# EAGLE schematic swift-nav (EAGLE 6.2)

## Sheet 1 of 7
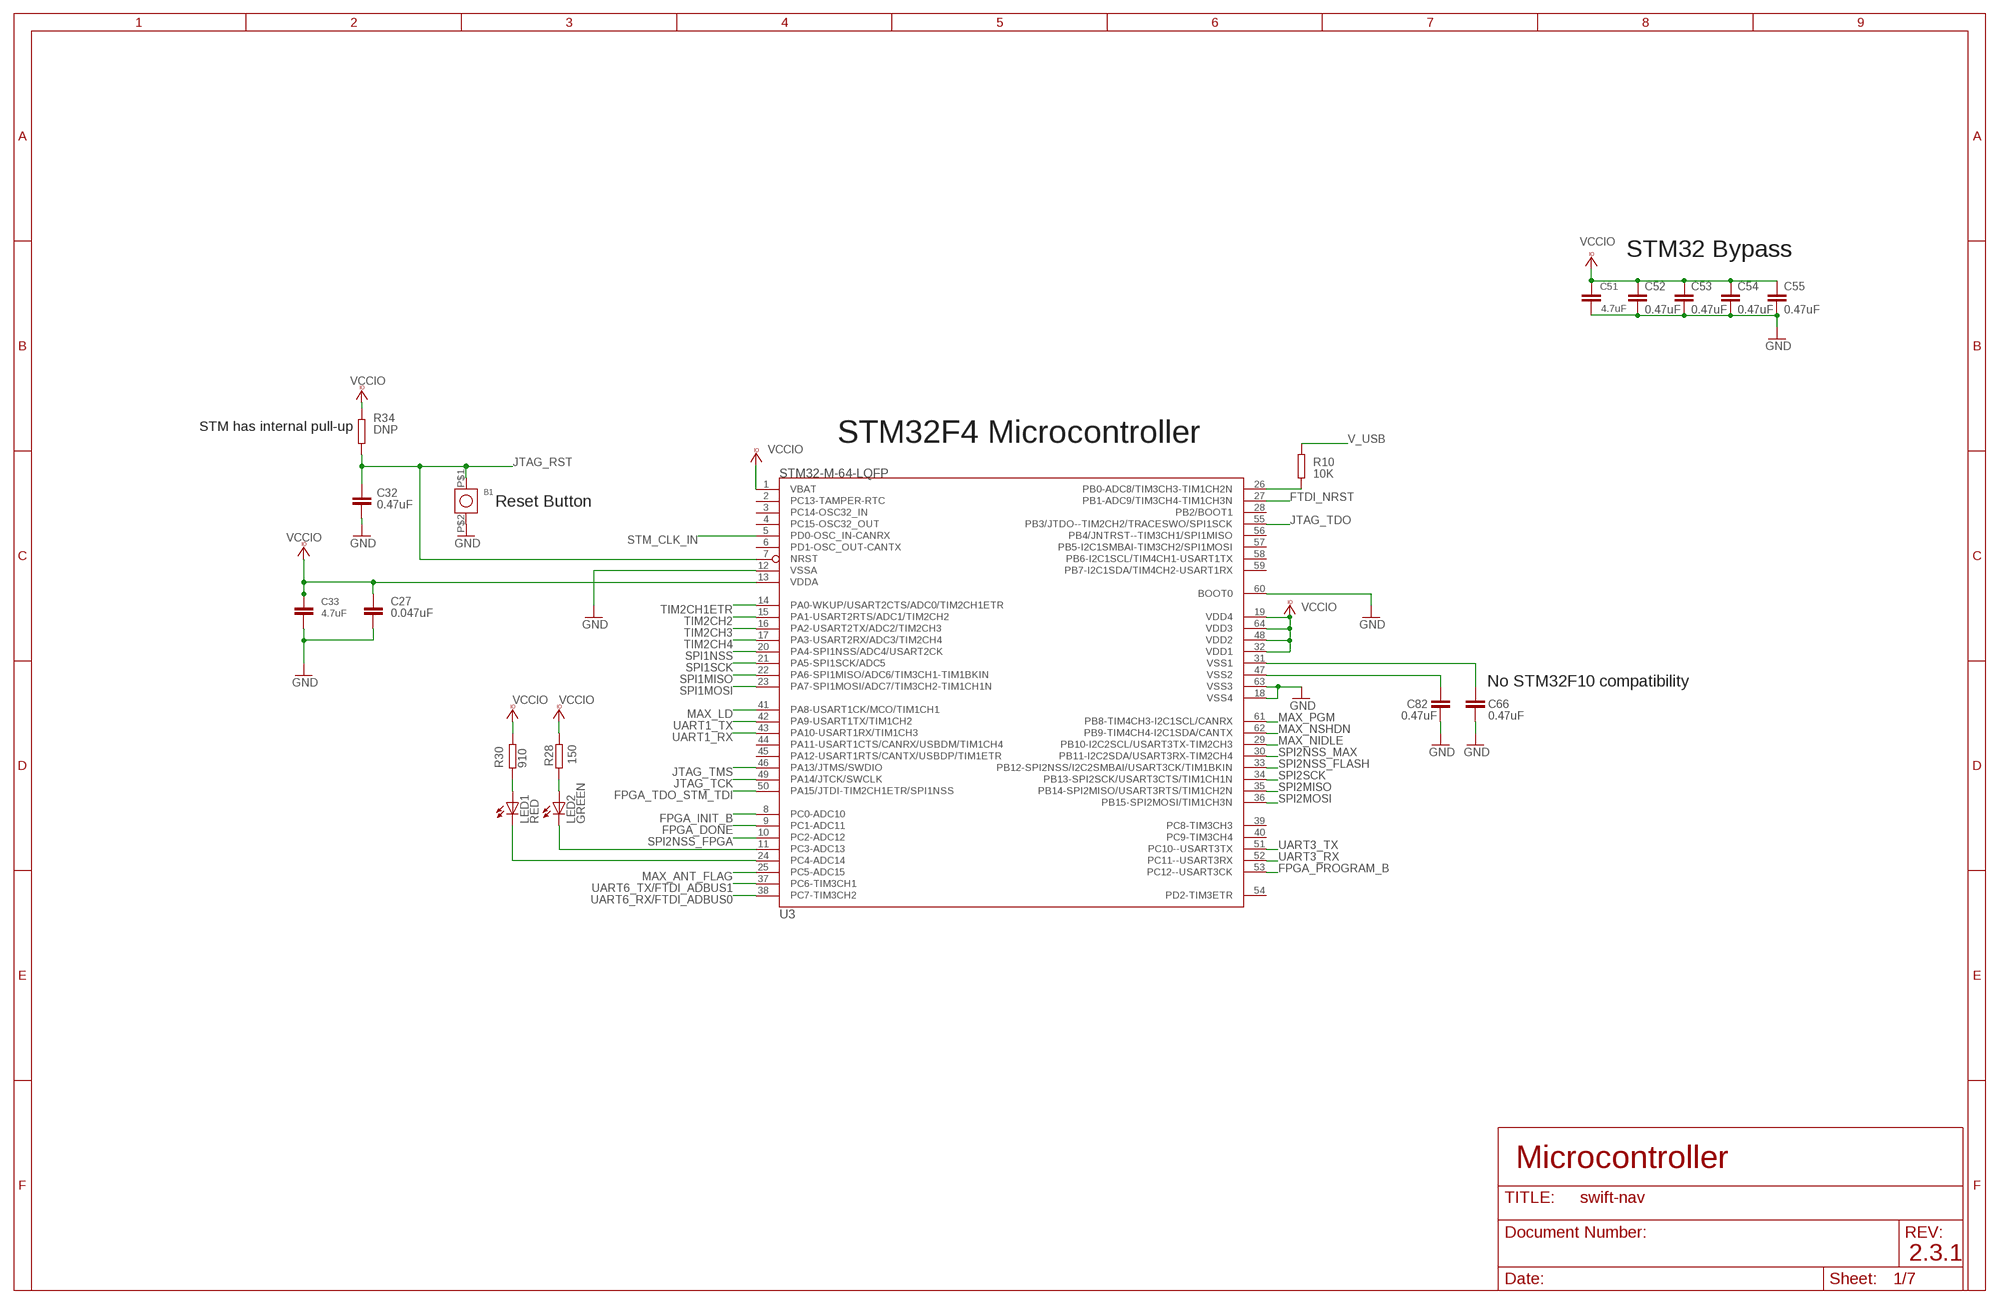
[diagram p0: schematic, sheet 1]

### Parts
B1  B3U-1000P  [B3U-1000P]
C27  0.047uF  CAPACITOR-0402  [0402-CAP]
C32  0.47uF  CAPACITOR-0402  [0402-CAP]
C33  4.7uF  CAPACITOR-0603  [0603-CAP]
C51  4.7uF  CAPACITOR-0603  [0603-CAP]
C52  0.47uF  CAPACITOR-0402  [0402-CAP]
C53  0.47uF  CAPACITOR-0402  [0402-CAP]
C54  0.47uF  CAPACITOR-0402  [0402-CAP]
C55  0.47uF  CAPACITOR-0402  [0402-CAP]
C66  0.47uF  CAPACITOR-0402  [0402-CAP]
C82  0.47uF  CAPACITOR-0402  [0402-CAP]
LED1  RED  LED-0603  [0603-LED]
LED2  GREEN  LED-0603  [0603-LED]
R10  10K  RESISTOR-0402  [0402-RES]
R28  150  RESISTOR-0402  [0402-RES]
R30  910  RESISTOR-0402  [0402-RES]
R34  DNP  RESISTOR-0402  [0402-RES]
U3  STM32-M-64-LQFP  [LQFP64]

### Nets
FPGA_DONE: U3.9(PC1-ADC11) ; also sheet 2
FPGA_INIT_B: U3.8(PC0-ADC10) ; also sheet 2
FPGA_PROGRAM_B: U3.53(PC12--USART3CK) ; also sheet 2
FPGA_TDO_STM_TDI: U3.50(PA15/JTDI-TIM2CH1ETR/SPI1NSS) ; also sheet 2
FTDI_NRST: U3.27(PB1-ADC9/TIM3CH4-TIM1CH3N) ; also sheet 6
GND: B1.P$2 C27.P$2 C32.P$2 C33.P$1 C51.P$1 C52.P$2 C53.P$2 C54.P$2 C55.P$2 C66.P$2 C82.P$1 U3.12(VSSA) U3.18(VSS4) U3.60(BOOT0) U3.63(VSS3) ; also sheet 2,3,4,5,6,7
JTAG_RST: B1.P$1 C32.P$1 R34.P$1 U3.7(NRST) ; also sheet 7
JTAG_TCK: U3.49(PA14/JTCK/SWCLK) ; also sheet 2,7
JTAG_TDO: U3.55(PB3/JTDO--TIM2CH2/TRACESWO/SPI1SCK) ; also sheet 7
JTAG_TMS: U3.46(PA13/JTMS/SWDIO) ; also sheet 2,7
MAX_ANT_FLAG: U3.25(PC5-ADC15) ; also sheet 4
MAX_LD: U3.41(PA8-USART1CK/MCO/TIM1CH1) ; also sheet 4
MAX_NIDLE: U3.29(PB10-I2C2SCL/USART3TX-TIM2CH3) ; also sheet 4
MAX_NSHDN: U3.62(PB9-TIM4CH4-I2C1SDA/CANTX) ; also sheet 4
MAX_PGM: U3.61(PB8-TIM4CH3-I2C1SCL/CANRX) ; also sheet 4
N$18: R10.P$1 U3.26(PB0-ADC8/TIM3CH3-TIM1CH2N)
N$24: LED1.A R30.P$1
N$39: LED1.C U3.24(PC4-ADC14)
N$55: LED2.A R28.P$2
N$59: LED2.C U3.11(PC3-ADC13)
SPI1MISO: U3.22(PA6-SPI1MISO/ADC6/TIM3CH1-TIM1BKIN) ; also sheet 2
SPI1MOSI: U3.23(PA7-SPI1MOSI/ADC7/TIM3CH2-TIM1CH1N) ; also sheet 2
SPI1NSS: U3.20(PA4-SPI1NSS/ADC4/USART2CK) ; also sheet 2
SPI1SCK: U3.21(PA5-SPI1SCK/ADC5) ; also sheet 2
SPI2MISO: U3.35(PB14-SPI2MISO/USART3RTS/TIM1CH2N) ; also sheet 2
SPI2MOSI: U3.36(PB15-SPI2MOSI/TIM1CH3N) ; also sheet 2,4
SPI2NSS_FLASH: U3.33(PB12-SPI2NSS/I2C2SMBAI/USART3CK/TIM1BKIN) ; also sheet 2
SPI2NSS_FPGA: U3.10(PC2-ADC12)
SPI2NSS_MAX: U3.30(PB11-I2C2SDA/USART3RX-TIM2CH4) ; also sheet 4
SPI2SCK: U3.34(PB13-SPI2SCK/USART3CTS/TIM1CH1N) ; also sheet 2,4
STM_CLK_IN: U3.5(PD0-OSC_IN-CANRX) ; also sheet 2
TIM2CH1ETR: U3.14(PA0-WKUP/USART2CTS/ADC0/TIM2CH1ETR) ; also sheet 2
TIM2CH2: U3.15(PA1-USART2RTS/ADC1/TIM2CH2) ; also sheet 2
TIM2CH3: U3.16(PA2-USART2TX/ADC2/TIM2CH3) ; also sheet 2
TIM2CH4: U3.17(PA3-USART2RX/ADC3/TIM2CH4) ; also sheet 2
UART1_RX: U3.43(PA10-USART1RX/TIM1CH3) ; also sheet 7
UART1_TX: U3.42(PA9-USART1TX/TIM1CH2) ; also sheet 7
UART3_RX: U3.52(PC11--USART3RX) ; also sheet 7
UART3_TX: U3.51(PC10--USART3TX) ; also sheet 7
UART6_RX/FTDI_ADBUS0: U3.38(PC7-TIM3CH2) ; also sheet 2,6
UART6_TX/FTDI_ADBUS1: U3.37(PC6-TIM3CH1) ; also sheet 2,6
V_USB: R10.P$2 ; also sheet 6,7
VCCIO: C27.P$1 C33.P$2 C51.P$2 C52.P$1 C53.P$1 C54.P$1 C55.P$1 R28.P$1 R30.P$2 R34.P$2 U3.1(VBAT) U3.13(VDDA) U3.19(VDD4) U3.32(VDD1) U3.48(VDD2) U3.64(VDD3) ; also sheet 2,3,4,5,6,7
VSS1: C66.P$1 U3.31(VSS1)
VSS2: C82.P$2 U3.47(VSS2)
Unconnected: U3.2(PC13-TAMPER-RTC) U3.3(PC14-OSC32_IN) U3.4(PC15-OSC32_OUT) U3.6(PD1-OSC_OUT-CANTX) U3.28(PB2/BOOT1) U3.39(PC8-TIM3CH3) U3.40(PC9-TIM3CH4) U3.44(PA11-USART1CTS/CANRX/USBDM/TIM1CH4) U3.45(PA12-USART1RTS/CANTX/USBDP/TIM1ETR) U3.54(PD2-TIM3ETR) U3.56(PB4/JNTRST--TIM3CH1/SPI1MISO) U3.57(PB5-I2C1SMBAI-TIM3CH2/SPI1MOSI) U3.58(PB6-I2C1SCL/TIM4CH1-USART1TX) U3.59(PB7-I2C1SDA/TIM4CH2-USART1RX)

### Notes on the sheet
- STM32 Bypass
- STM has internal pull-up
- STM32F4 Microcontroller
- Reset Button
- No STM32F10 compatibility
- Microcontroller
- 2.3.1

## Sheet 2 of 7
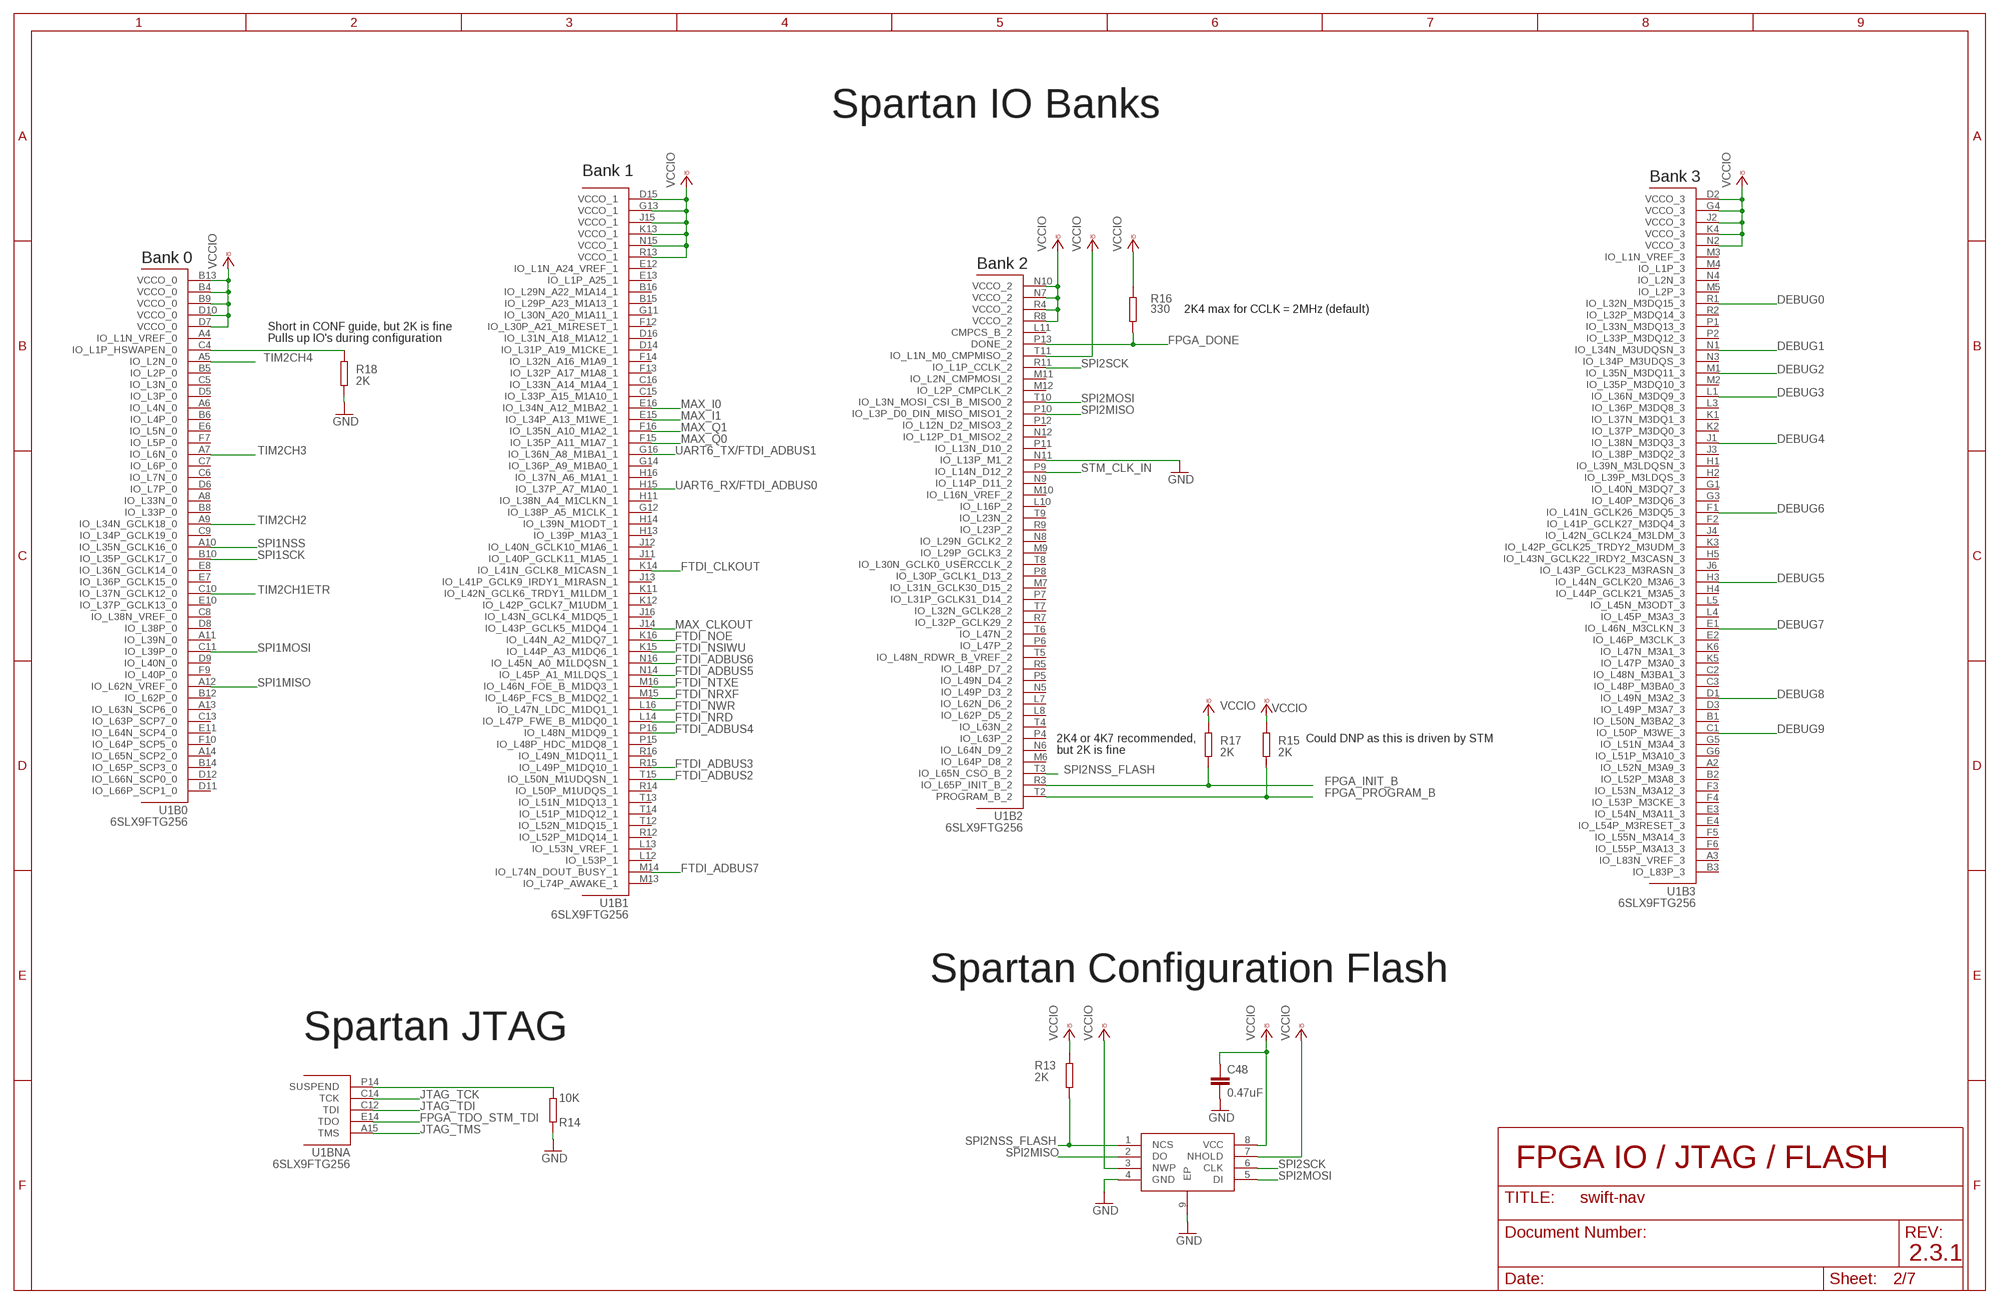
[diagram p1: schematic, sheet 2]

### Parts
C48  0.47uF  CAPACITOR-0402  [0402-CAP]
R13  2K  RESISTOR-0402  [0402-RES]
R14  10K  RESISTOR-0402  [0402-RES]
R15  2K  RESISTOR-0402  [0402-RES]
R16  330  RESISTOR-0402  [0402-RES]
R17  2K  RESISTOR-0402  [0402-RES]
R18  2K  RESISTOR-0402  [0402-RES]
U1  6SLX9FTG256  [FT256]
U13  M25PX80  M25P80_MLP8  [M25P80_MLP8]

### Nets
DEBUG0: U1.R1(B3:IO_L32N_M3DQ15_3) ; also sheet 7
DEBUG1: U1.N1(B3:IO_L34N_M3UDQSN_3) ; also sheet 7
DEBUG2: U1.M1(B3:IO_L35N_M3DQ11_3) ; also sheet 7
DEBUG3: U1.L1(B3:IO_L36N_M3DQ9_3) ; also sheet 7
DEBUG4: U1.J1(B3:IO_L38N_M3DQ3_3) ; also sheet 7
DEBUG5: U1.H3(B3:IO_L44N_GCLK20_M3A6_3) ; also sheet 7
DEBUG6: U1.F1(B3:IO_L41N_GCLK26_M3DQ5_3) ; also sheet 7
DEBUG7: U1.E1(B3:IO_L46N_M3CLKN_3) ; also sheet 7
DEBUG8: U1.D1(B3:IO_L49N_M3A2_3) ; also sheet 7
DEBUG9: U1.C1(B3:IO_L50P_M3WE_3) ; also sheet 7
FPGA_DONE: R16.P$1 U1.P13(B2:DONE_2) ; also sheet 1
FPGA_INIT_B: R17.P$2 U1.R3(B2:IO_L65P_INIT_B_2) ; also sheet 1
FPGA_PROGRAM_B: R15.P$2 U1.T2(B2:PROGRAM_B_2) ; also sheet 1
FPGA_TDO_STM_TDI: U1.E14(BNA:TDO) ; also sheet 1
FTDI_ADBUS2: U1.T15(B1:IO_L50N_M1UDQSN_1) ; also sheet 6
FTDI_ADBUS3: U1.R15(B1:IO_L49P_M1DQ10_1) ; also sheet 6
FTDI_ADBUS4: U1.P16(B1:IO_L48N_M1DQ9_1) ; also sheet 6
FTDI_ADBUS5: U1.N14(B1:IO_L45P_A1_M1LDQS_1) ; also sheet 6
FTDI_ADBUS6: U1.N16(B1:IO_L45N_A0_M1LDQSN_1) ; also sheet 6
FTDI_ADBUS7: U1.M14(B1:IO_L74N_DOUT_BUSY_1) ; also sheet 6
FTDI_CLKOUT: U1.K14(B1:IO_L41N_GCLK8_M1CASN_1) ; also sheet 6
FTDI_NOE: U1.K16(B1:IO_L44N_A2_M1DQ7_1) ; also sheet 6
FTDI_NRD: U1.L14(B1:IO_L47P_FWE_B_M1DQ0_1) ; also sheet 6
FTDI_NRXF: U1.M15(B1:IO_L46P_FCS_B_M1DQ2_1) ; also sheet 6
FTDI_NSIWU: U1.K15(B1:IO_L44P_A3_M1DQ6_1) ; also sheet 6
FTDI_NTXE: U1.M16(B1:IO_L46N_FOE_B_M1DQ3_1) ; also sheet 6
FTDI_NWR: U1.L16(B1:IO_L47N_LDC_M1DQ1_1) ; also sheet 6
GND: C48.P$2 R14.P$2 R18.P$1 U1.N11(B2:IO_L13P_M1_2) U13.4(GND) U13.9(EP) ; also sheet 1,3,4,5,6,7
JTAG_TCK: U1.C14(BNA:TCK) ; also sheet 1,7
JTAG_TDI: U1.C12(BNA:TDI) ; also sheet 7
JTAG_TMS: U1.A15(BNA:TMS) ; also sheet 1,7
MAX_CLKOUT: U1.J14(B1:IO_L43P_GCLK5_M1DQ4_1) ; also sheet 4
MAX_I0: U1.E16(B1:IO_L34N_A12_M1BA2_1) ; also sheet 4
MAX_I1: U1.E15(B1:IO_L34P_A13_M1WE_1) ; also sheet 4
MAX_Q0: U1.F15(B1:IO_L35P_A11_M1A7_1) ; also sheet 4
MAX_Q1: U1.F16(B1:IO_L35N_A10_M1A2_1) ; also sheet 4
N$31: R18.P$2 U1.C4(B0:IO_L1P_HSWAPEN_0)
N$34: R14.P$1 U1.P14(BNA:SUSPEND)
SPI1MISO: U1.A12(B0:IO_L62N_VREF_0) ; also sheet 1
SPI1MOSI: U1.C11(B0:IO_L39P_0) ; also sheet 1
SPI1NSS: U1.A10(B0:IO_L35N_GCLK16_0) ; also sheet 1
SPI1SCK: U1.B10(B0:IO_L35P_GCLK17_0) ; also sheet 1
SPI2MISO: U1.P10(B2:IO_L3P_D0_DIN_MISO_MISO1_2) U13.2(DO) ; also sheet 1
SPI2MOSI: U1.T10(B2:IO_L3N_MOSI_CSI_B_MISO0_2) U13.5(DI) ; also sheet 1,4
SPI2NSS_FLASH: R13.P$1 U1.T3(B2:IO_L65N_CSO_B_2) U13.1(NCS) ; also sheet 1
SPI2SCK: U1.R11(B2:IO_L1P_CCLK_2) U13.6(CLK) ; also sheet 1,4
STM_CLK_IN: U1.P9(B2:IO_L14N_D12_2) ; also sheet 1
TIM2CH1ETR: U1.C10(B0:IO_L37N_GCLK12_0) ; also sheet 1
TIM2CH2: U1.A9(B0:IO_L34N_GCLK18_0) ; also sheet 1
TIM2CH3: U1.A7(B0:IO_L6N_0) ; also sheet 1
TIM2CH4: U1.A5(B0:IO_L2N_0) ; also sheet 1
UART6_RX/FTDI_ADBUS0: U1.H15(B1:IO_L37P_A7_M1A0_1) ; also sheet 1,6
UART6_TX/FTDI_ADBUS1: U1.G16(B1:IO_L36N_A8_M1BA1_1) ; also sheet 1,6
VCCIO: C48.P$1 R13.P$2 R15.P$1 R16.P$2 R17.P$1 U1.B4(B0:VCCO_0) U1.B9(B0:VCCO_0) U1.B13(B0:VCCO_0) U1.D2(B3:VCCO_3) U1.D7(B0:VCCO_0) U1.D10(B0:VCCO_0) U1.D15(B1:VCCO_1) U1.G4(B3:VCCO_3) U1.G13(B1:VCCO_1) U1.J2(B3:VCCO_3) U1.J15(B1:VCCO_1) U1.K4(B3:VCCO_3) U1.K13(B1:VCCO_1) U1.N2(B3:VCCO_3) U1.N7(B2:VCCO_2) U1.N10(B2:VCCO_2) U1.N15(B1:VCCO_1) U1.R4(B2:VCCO_2) U1.R8(B2:VCCO_2) U1.R13(B1:VCCO_1) U1.T11(B2:IO_L1N_M0_CMPMISO_2) U13.3(NWP) U13.7(NHOLD) U13.8(VCC) ; also sheet 1,3,4,5,6,7
Unconnected: U1.A2(B3:IO_L52N_M3A9_3) U1.A3(B3:IO_L83N_VREF_3) U1.A4(B0:IO_L1N_VREF_0) U1.A6(B0:IO_L4N_0) U1.A8(B0:IO_L33N_0) U1.A11(B0:IO_L39N_0) U1.A13(B0:IO_L63N_SCP6_0) U1.A14(B0:IO_L65N_SCP2_0) U1.B1(B3:IO_L50N_M3BA2_3) U1.B2(B3:IO_L52P_M3A8_3) U1.B3(B3:IO_L83P_3) U1.B5(B0:IO_L2P_0) U1.B6(B0:IO_L4P_0) U1.B8(B0:IO_L33P_0) U1.B12(B0:IO_L62P_0) U1.B14(B0:IO_L65P_SCP3_0) U1.B15(B1:IO_L29P_A23_M1A13_1) U1.B16(B1:IO_L29N_A22_M1A14_1) U1.C2(B3:IO_L48N_M3BA1_3) U1.C3(B3:IO_L48P_M3BA0_3) U1.C5(B0:IO_L3N_0) U1.C6(B0:IO_L7N_0) U1.C7(B0:IO_L6P_0) U1.C8(B0:IO_L38N_VREF_0) U1.C9(B0:IO_L34P_GCLK19_0) U1.C13(B0:IO_L63P_SCP7_0) U1.C15(B1:IO_L33P_A15_M1A10_1) U1.C16(B1:IO_L33N_A14_M1A4_1) U1.D3(B3:IO_L49P_M3A7_3) U1.D5(B0:IO_L3P_0) U1.D6(B0:IO_L7P_0) U1.D8(B0:IO_L38P_0) U1.D9(B0:IO_L40N_0) U1.D11(B0:IO_L66P_SCP1_0) U1.D12(B0:IO_L66N_SCP0_0) U1.D14(B1:IO_L31P_A19_M1CKE_1) U1.D16(B1:IO_L31N_A18_M1A12_1) U1.E2(B3:IO_L46P_M3CLK_3) U1.E3(B3:IO_L54N_M3A11_3) U1.E4(B3:IO_L54P_M3RESET_3) U1.E6(B0:IO_L5N_0) U1.E7(B0:IO_L36P_GCLK15_0) U1.E8(B0:IO_L36N_GCLK14_0) U1.E10(B0:IO_L37P_GCLK13_0) U1.E11(B0:IO_L64N_SCP4_0) U1.E12(B1:IO_L1N_A24_VREF_1) U1.E13(B1:IO_L1P_A25_1) U1.F2(B3:IO_L41P_GCLK27_M3DQ4_3) U1.F3(B3:IO_L53N_M3A12_3) U1.F4(B3:IO_L53P_M3CKE_3) U1.F5(B3:IO_L55N_M3A14_3) U1.F6(B3:IO_L55P_M3A13_3) U1.F7(B0:IO_L5P_0) U1.F9(B0:IO_L40P_0) U1.F10(B0:IO_L64P_SCP5_0) U1.F12(B1:IO_L30P_A21_M1RESET_1) U1.F13(B1:IO_L32P_A17_M1A8_1) U1.F14(B1:IO_L32N_A16_M1A9_1) U1.G1(B3:IO_L40N_M3DQ7_3) U1.G3(B3:IO_L40P_M3DQ6_3) U1.G5(B3:IO_L51N_M3A4_3) U1.G6(B3:IO_L51P_M3A10_3) U1.G11(B1:IO_L30N_A20_M1A11_1) U1.G12(B1:IO_L38P_A5_M1CLK_1) U1.G14(B1:IO_L36P_A9_M1BA0_1) U1.H1(B3:IO_L39N_M3LDQSN_3) U1.H2(B3:IO_L39P_M3LDQS_3) U1.H4(B3:IO_L44P_GCLK21_M3A5_3) U1.H5(B3:IO_L43N_GCLK22_IRDY2_M3CASN_3) U1.H11(B1:IO_L38N_A4_M1CLKN_1) U1.H13(B1:IO_L39P_M1A3_1) U1.H14(B1:IO_L39N_M1ODT_1) U1.H16(B1:IO_L37N_A6_M1A1_1) U1.J3(B3:IO_L38P_M3DQ2_3) U1.J4(B3:IO_L42N_GCLK24_M3LDM_3) U1.J6(B3:IO_L43P_GCLK23_M3RASN_3) U1.J11(B1:IO_L40P_GCLK11_M1A5_1) U1.J12(B1:IO_L40N_GCLK10_M1A6_1) U1.J13(B1:IO_L41P_GCLK9_IRDY1_M1RASN_1) U1.J16(B1:IO_L43N_GCLK4_M1DQ5_1) U1.K1(B3:IO_L37N_M3DQ1_3) U1.K2(B3:IO_L37P_M3DQ0_3) U1.K3(B3:IO_L42P_GCLK25_TRDY2_M3UDM_3) U1.K5(B3:IO_L47P_M3A0_3) U1.K6(B3:IO_L47N_M3A1_3) U1.K11(B1:IO_L42N_GCLK6_TRDY1_M1LDM_1) U1.K12(B1:IO_L42P_GCLK7_M1UDM_1) U1.L3(B3:IO_L36P_M3DQ8_3) U1.L4(B3:IO_L45P_M3A3_3) U1.L5(B3:IO_L45N_M3ODT_3) U1.L7(B2:IO_L62N_D6_2) U1.L8(B2:IO_L62P_D5_2) U1.L10(B2:IO_L16P_2) U1.L11(B2:CMPCS_B_2) U1.L12(B1:IO_L53P_1) U1.L13(B1:IO_L53N_VREF_1) U1.M2(B3:IO_L35P_M3DQ10_3) U1.M3(B3:IO_L1N_VREF_3) U1.M4(B3:IO_L1P_3) U1.M5(B3:IO_L2P_3) U1.M6(B2:IO_L64P_D8_2) U1.M7(B2:IO_L31N_GCLK30_D15_2) U1.M9(B2:IO_L29P_GCLK3_2) U1.M10(B2:IO_L16N_VREF_2) U1.M11(B2:IO_L2N_CMPMOSI_2) U1.M12(B2:IO_L2P_CMPCLK_2) U1.M13(B1:IO_L74P_AWAKE_1) U1.N3(B3:IO_L34P_M3UDQS_3) U1.N4(B3:IO_L2N_3) U1.N5(B2:IO_L49P_D3_2) U1.N6(B2:IO_L64N_D9_2) U1.N8(B2:IO_L29N_GCLK2_2) U1.N9(B2:IO_L14P_D11_2) U1.N12(B2:IO_L12P_D1_MISO2_2) U1.P1(B3:IO_L33N_M3DQ13_3) U1.P2(B3:IO_L33P_M3DQ12_3) U1.P4(B2:IO_L63P_2) U1.P5(B2:IO_L49N_D4_2) U1.P6(B2:IO_L47P_2) U1.P7(B2:IO_L31P_GCLK31_D14_2) U1.P8(B2:IO_L30P_GCLK1_D13_2) U1.P11(B2:IO_L13N_D10_2) U1.P12(B2:IO_L12N_D2_MISO3_2) U1.P15(B1:IO_L48P_HDC_M1DQ8_1) U1.R2(B3:IO_L32P_M3DQ14_3) U1.R5(B2:IO_L48P_D7_2) U1.R7(B2:IO_L32P_GCLK29_2) U1.R9(B2:IO_L23P_2) U1.R12(B1:IO_L52P_M1DQ14_1) U1.R14(B1:IO_L50P_M1UDQS_1) U1.R16(B1:IO_L49N_M1DQ11_1) U1.T4(B2:IO_L63N_2) U1.T5(B2:IO_L48N_RDWR_B_VREF_2) U1.T6(B2:IO_L47N_2) U1.T7(B2:IO_L32N_GCLK28_2) U1.T8(B2:IO_L30N_GCLK0_USERCCLK_2) U1.T9(B2:IO_L23N_2) U1.T12(B1:IO_L52N_M1DQ15_1) U1.T13(B1:IO_L51N_M1DQ13_1) U1.T14(B1:IO_L51P_M1DQ12_1)

### Notes on the sheet
- Spartan IO Banks
- Bank 1
- Bank 3
- Bank 0
- Bank 2
- 2K4 max for CCLK = 2MHz (default)
- Short in CONF guide, but 2K is fine
- Pulls up IO's during configuration
- 2K4 or 4K7 recommended, | Could DNP as this is driven by STM
- but 2K is fine
- Spartan Configuration Flash
- Spartan JTAG
- FPGA IO / JTAG / FLASH
- 2.3.1

## Sheet 3 of 7
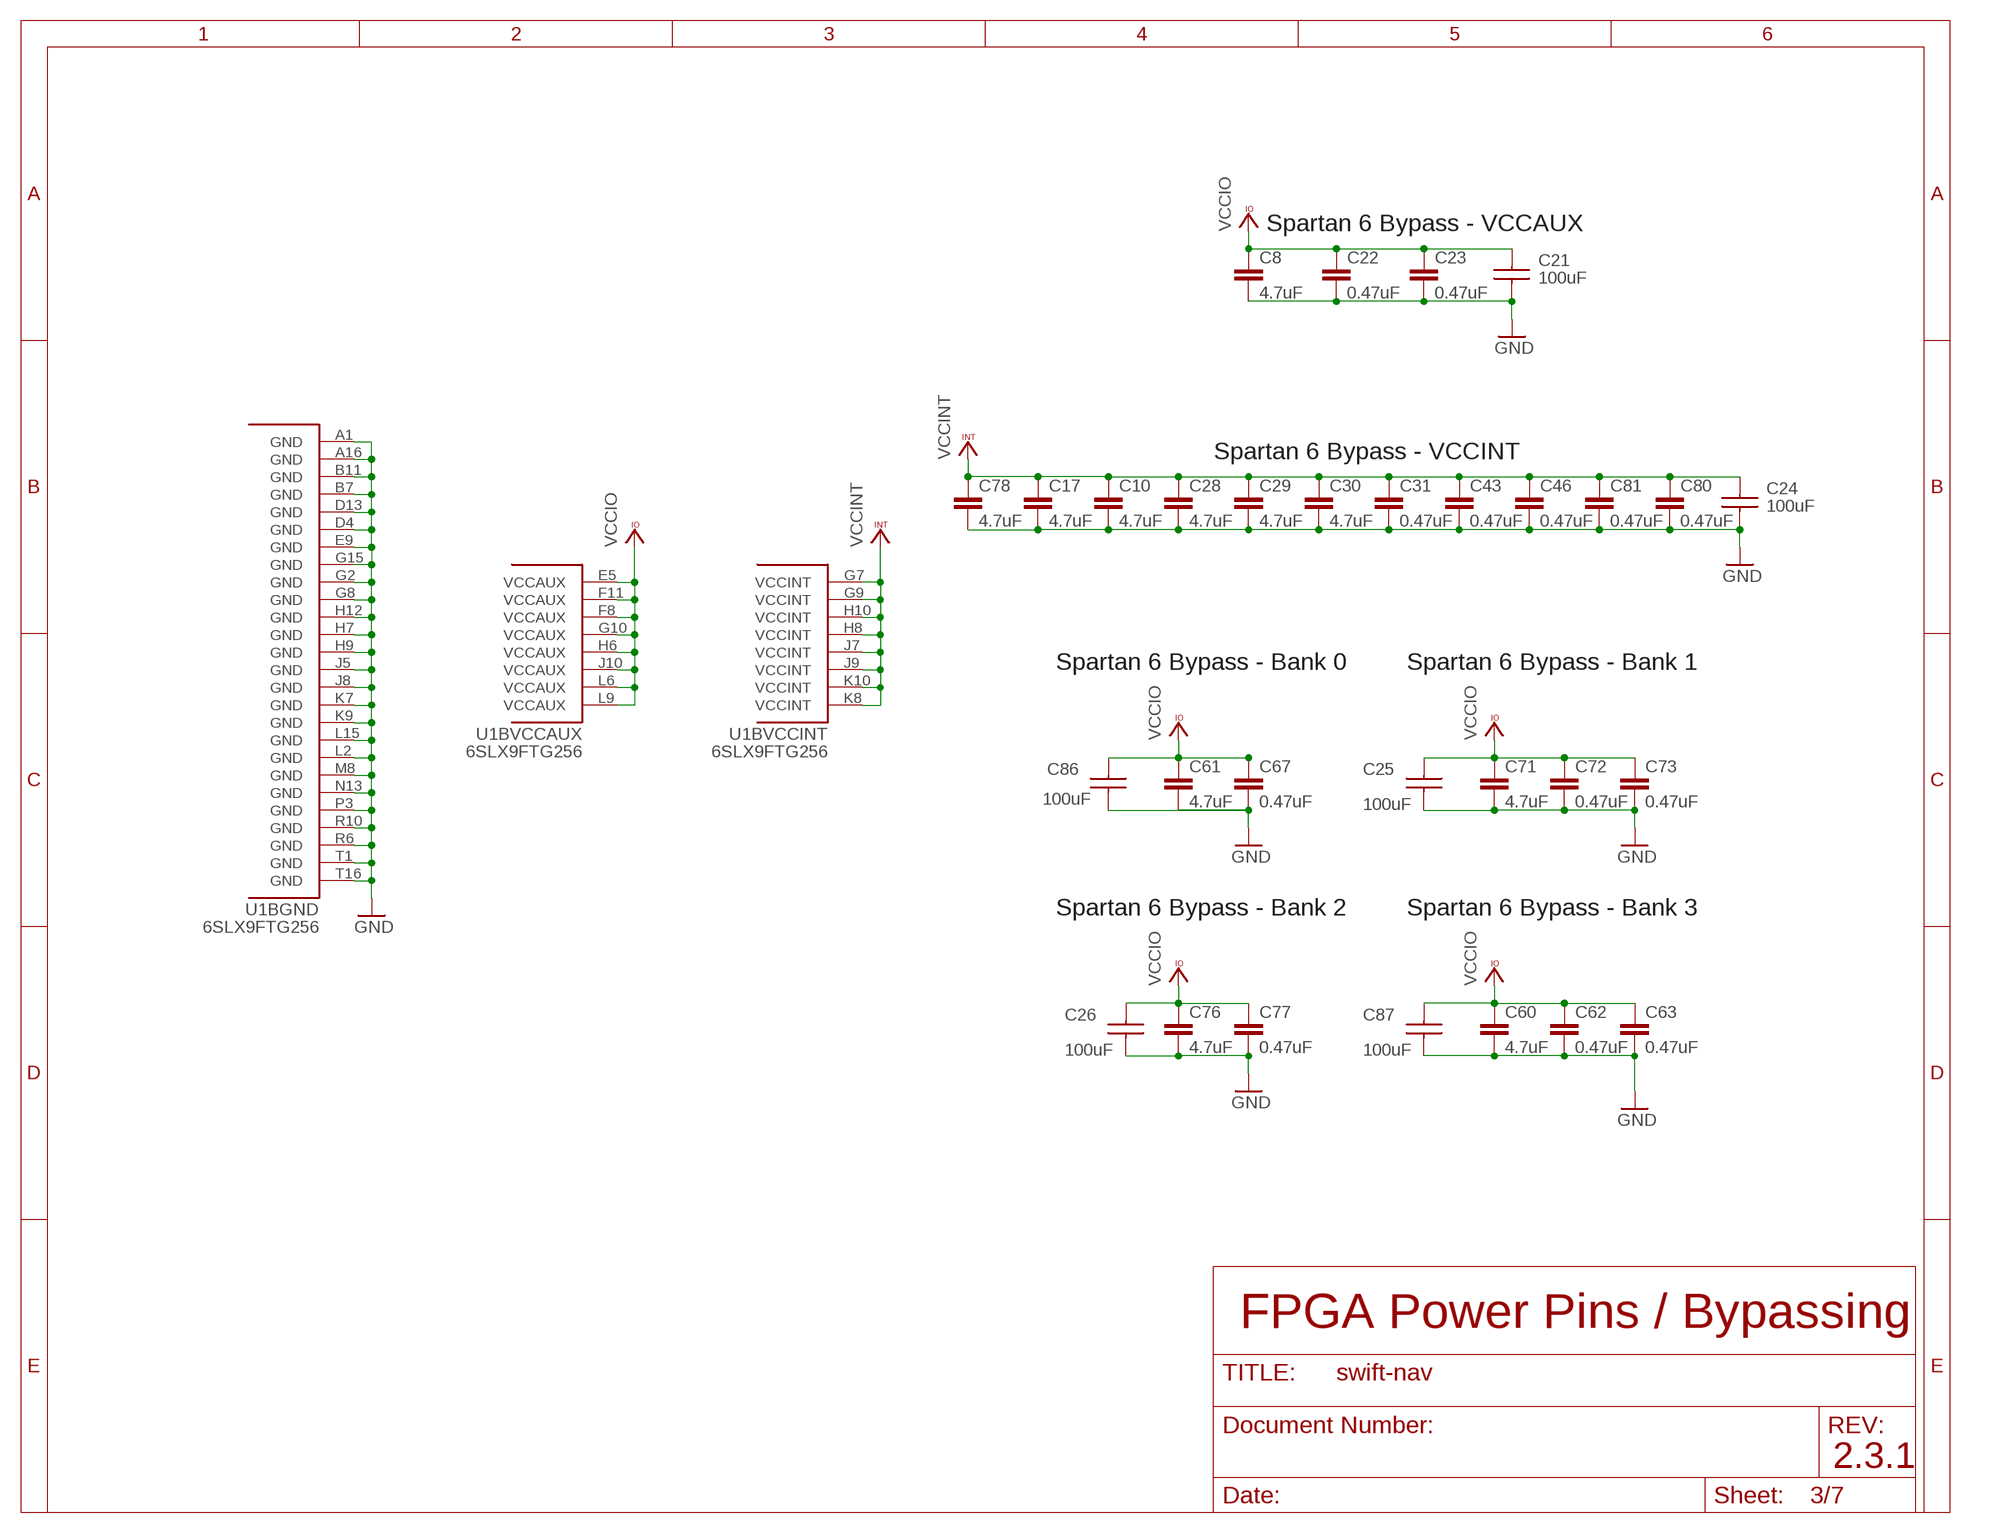
[diagram p2: schematic, sheet 3]

### Parts
C8  4.7uF  CAPACITOR-0603  [0603-CAP]
C10  4.7uF  CAPACITOR-0603  [0603-CAP]
C17  4.7uF  CAPACITOR-0603  [0603-CAP]
C21  100uF  C1210  [C1210]
C22  0.47uF  CAPACITOR-0402  [0402-CAP]
C23  0.47uF  CAPACITOR-0402  [0402-CAP]
C24  100uF  C1210  [C1210]
C25  100uF  C1210  [C1210]
C26  100uF  C1210  [C1210]
C28  4.7uF  CAPACITOR-0603  [0603-CAP]
C29  4.7uF  CAPACITOR-0603  [0603-CAP]
C30  4.7uF  CAPACITOR-0603  [0603-CAP]
C31  0.47uF  CAPACITOR-0402  [0402-CAP]
C43  0.47uF  CAPACITOR-0402  [0402-CAP]
C46  0.47uF  CAPACITOR-0402  [0402-CAP]
C60  4.7uF  CAPACITOR-0603  [0603-CAP]
C61  4.7uF  CAPACITOR-0603  [0603-CAP]
C62  0.47uF  CAPACITOR-0402  [0402-CAP]
C63  0.47uF  CAPACITOR-0402  [0402-CAP]
C67  0.47uF  CAPACITOR-0402  [0402-CAP]
C71  4.7uF  CAPACITOR-0603  [0603-CAP]
C72  0.47uF  CAPACITOR-0402  [0402-CAP]
C73  0.47uF  CAPACITOR-0402  [0402-CAP]
C76  4.7uF  CAPACITOR-0603  [0603-CAP]
C77  0.47uF  CAPACITOR-0402  [0402-CAP]
C78  4.7uF  CAPACITOR-0603  [0603-CAP]
C80  0.47uF  CAPACITOR-0402  [0402-CAP]
C81  0.47uF  CAPACITOR-0402  [0402-CAP]
C86  100uF  C1210  [C1210]
C87  100uF  C1210  [C1210]

### Nets
GND: C8.P$2 C10.P$2 C17.P$2 C21.P$2 C22.P$2 C23.P$2 C24.P$2 C25.P$2 C26.P$2 C28.P$2 C29.P$2 C30.P$2 C31.P$2 C43.P$2 C46.P$2 C60.P$2 C61.P$2 C62.P$2 C63.P$2 C67.P$2 C71.P$2 C72.P$2 C73.P$2 C76.P$2 C77.P$2 C78.P$2 C80.P$2 C81.P$2 C86.P$2 C87.P$2 U1.A1(BGND:GND) U1.A16(BGND:GND) U1.B7(BGND:GND) U1.B11(BGND:GND) U1.D4(BGND:GND) U1.D13(BGND:GND) U1.E9(BGND:GND) U1.G2(BGND:GND) U1.G8(BGND:GND) U1.G15(BGND:GND) U1.H7(BGND:GND) U1.H9(BGND:GND) U1.H12(BGND:GND) U1.J5(BGND:GND) U1.J8(BGND:GND) U1.K7(BGND:GND) U1.K9(BGND:GND) U1.L2(BGND:GND) U1.L15(BGND:GND) U1.M8(BGND:GND) U1.N13(BGND:GND) U1.P3(BGND:GND) U1.R6(BGND:GND) U1.R10(BGND:GND) U1.T1(BGND:GND) U1.T16(BGND:GND) ; also sheet 1,2,4,5,6,7
VCCINT: C10.P$1 C17.P$1 C24.P$1 C28.P$1 C29.P$1 C30.P$1 C31.P$1 C43.P$1 C46.P$1 C78.P$1 C80.P$1 C81.P$1 U1.G7(BVCCINT:VCCINT) U1.G9(BVCCINT:VCCINT) U1.H8(BVCCINT:VCCINT) U1.H10(BVCCINT:VCCINT) U1.J7(BVCCINT:VCCINT) U1.J9(BVCCINT:VCCINT) U1.K8(BVCCINT:VCCINT) U1.K10(BVCCINT:VCCINT) ; also sheet 5
VCCIO: C8.P$1 C21.P$1 C22.P$1 C23.P$1 C25.P$1 C26.P$1 C60.P$1 C61.P$1 C62.P$1 C63.P$1 C67.P$1 C71.P$1 C72.P$1 C73.P$1 C76.P$1 C77.P$1 C86.P$1 C87.P$1 U1.E5(BVCCAUX:VCCAUX) U1.F8(BVCCAUX:VCCAUX) U1.F11(BVCCAUX:VCCAUX) U1.G10(BVCCAUX:VCCAUX) U1.H6(BVCCAUX:VCCAUX) U1.J10(BVCCAUX:VCCAUX) U1.L6(BVCCAUX:VCCAUX) U1.L9(BVCCAUX:VCCAUX) ; also sheet 1,2,4,5,6,7

### Notes on the sheet
- Spartan 6 Bypass - VCCAUX
- Spartan 6 Bypass - VCCINT
- Spartan 6 Bypass - Bank 0 | Spartan 6 Bypass - Bank 1
- Spartan 6 Bypass - Bank 2 | Spartan 6 Bypass - Bank 3
- FPGA Power Pins / Bypassing
- 2.3.1

## Sheet 4 of 7
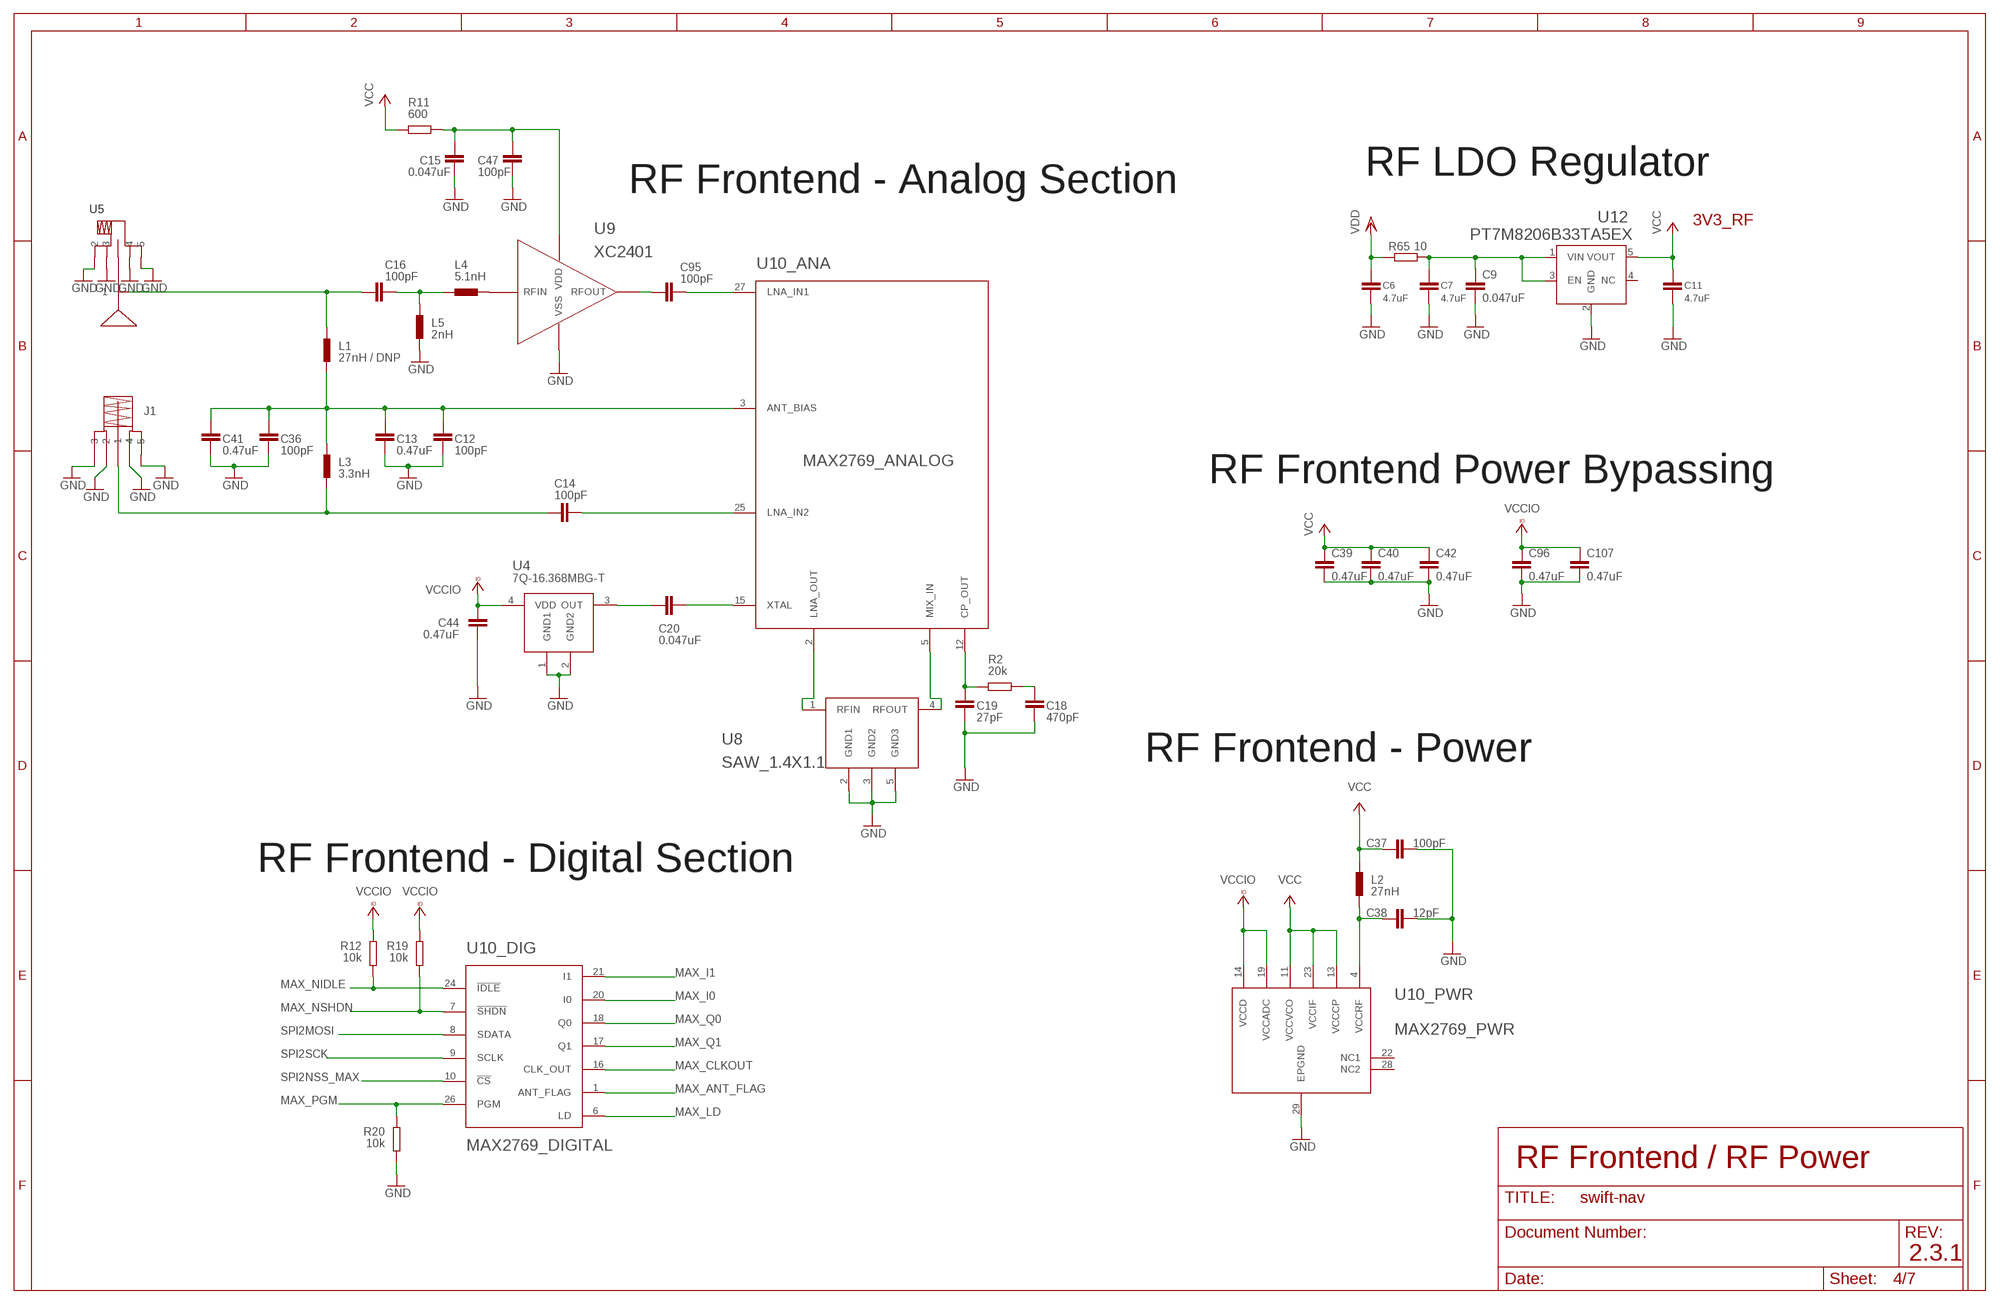
[diagram p3: schematic, sheet 4]

### Parts
C6  4.7uF  CAPACITOR-0603  [0603-CAP]
C7  4.7uF  CAPACITOR-0603  [0603-CAP]
C9  0.047uF  CAPACITOR-0402  [0402-CAP]
C11  4.7uF  CAPACITOR-0603  [0603-CAP]
C12  100pF  CAPACITOR-0402  [0402-CAP]
C13  0.47uF  CAPACITOR-0402  [0402-CAP]
C14  100pF  CAPACITOR-0402  [0402-CAP]
C15  0.047uF  CAPACITOR-0402  [0402-CAP]
C16  100pF  CAPACITOR-0402  [0402-CAP]
C18  470pF  CAPACITOR-0402  [0402-CAP]
C19  27pF  CAPACITOR-0402  [0402-CAP]
C20  0.047uF  CAPACITOR-0402  [0402-CAP]
C36  100pF  CAPACITOR-0402  [0402-CAP]
C37  100pF  CAPACITOR-0402  [0402-CAP]
C38  12pF  CAPACITOR-0402  [0402-CAP]
C39  0.47uF  CAPACITOR-0402  [0402-CAP]
C40  0.47uF  CAPACITOR-0402  [0402-CAP]
C41  0.47uF  CAPACITOR-0402  [0402-CAP]
C42  0.47uF  CAPACITOR-0402  [0402-CAP]
C44  0.47uF  CAPACITOR-0402  [0402-CAP]
C47  100pF  CAPACITOR-0402  [0402-CAP]
C95  100pF  CAPACITOR-0402  [0402-CAP]
C96  0.47uF  CAPACITOR-0402  [0402-CAP]
C107  0.47uF  CAPACITOR-0402  [0402-CAP]
J1  SMA_EDGE  [SMA_EDGE]
L1  27nH / DNP  INDUCTOR-0402  [0402-IND]
L2  27nH  INDUCTOR-0402  [0402-IND]
L3  3.3nH  INDUCTOR-0402  [0402-IND]
L4  5.1nH  INDUCTOR-0402  [0402-IND]
L5  2nH  INDUCTOR-0402  [0402-IND]
R2  20k  RESISTOR-0402  [0402-RES]
R11  600  RESISTOR-0402  [0402-RES]
R12  10k  RESISTOR-0402  [0402-RES]
R19  10k  RESISTOR-0402  [0402-RES]
R20  10k  RESISTOR-0402  [0402-RES]
R65  10  RESISTOR-0402  [0402-RES]
U4  7Q-16.368MBG-T  [TCX_7Q]
U5  SMA_PATCH_SMDGND  [SMA_PATCH_SMDGND]
U8  SAW_1.4X1.1  [SAW_1.4X1.1]
U9  XC2401  [XC2401]
U10  MAX2769  [MAX2769]
U12  PT7M8206B33TA5EX  [PT7M8206B33TA5EX]

### Nets
FE_CLK: C20.P$2 U4.3(OUT)
GND: C6.P$1 C7.P$1 C9.P$2 C11.P$1 C12.P$1 C13.P$1 C15.P$1 C18.P$2 C19.P$2 C36.P$1 C37.P$2 C38.P$2 C39.P$2 C40.P$2 C41.P$1 C42.P$2 C44.P$2 C47.P$1 C96.P$2 C107.P$2 J1.P2 J1.P3 J1.P4 J1.P5 L5.P$1 R20.P$1 U4.1(GND1) U4.2(GND2) U5.2 U5.3 U5.4 U5.5 U8.2(GND1) U8.3(GND2) U8.5(GND3) U9.3(VSS) U10.29(_PWR:EPGND) U12.2(GND) ; also sheet 1,2,3,5,6,7
MAX_ANT_FLAG: U10.1(_DIG:ANT_FLAG) ; also sheet 1
MAX_CLKOUT: U10.16(_DIG:CLK_OUT) ; also sheet 2
MAX_I0: U10.20(_DIG:I0) ; also sheet 2
MAX_I1: U10.21(_DIG:I1) ; also sheet 2
MAX_LD: U10.6(_DIG:LD) ; also sheet 1
MAX_NIDLE: R12.P$1 U10.24(_DIG:!IDLE) ; also sheet 1
MAX_NSHDN: R19.P$1 U10.7(_DIG:!SHDN) ; also sheet 1
MAX_PGM: R20.P$2 U10.26(_DIG:PGM) ; also sheet 1
MAX_Q0: U10.18(_DIG:Q0) ; also sheet 2
MAX_Q1: U10.17(_DIG:Q1) ; also sheet 2
N$2: L4.P$2 U9.4(RFIN)
N$3: C18.P$1 R2.P$1
N$4: C19.P$1 R2.P$2 U10.12(_ANA:CP_OUT)
N$5: U8.1(RFIN) U10.2(_ANA:LNA_OUT)
N$6: C20.P$1 U10.15(_ANA:XTAL)
N$7: U8.4(RFOUT) U10.5(_ANA:MIX_IN)
N$8: C14.P$1 J1.P1 L3.P$1
N$10: C12.P$2 C13.P$2 C36.P$2 C41.P$2 L1.P$1 L3.P$2 U10.3(_ANA:ANT_BIAS)
N$11: C95.P$2 U10.27(_ANA:LNA_IN1)
N$14: C16.P$1 L1.P$2 U5.1
N$22: C38.P$1 L2.P$1 U10.4(_PWR:VCCRF)
N$30: C14.P$2 U10.25(_ANA:LNA_IN2)
N$35: C16.P$2 L4.P$1 L5.P$2
N$36: C95.P$1 U9.2(RFOUT)
N$41: C15.P$2 C47.P$2 R11.P$1 U9.1(VDD)
N$56: C7.P$2 C9.P$1 R65.P$2 U12.1(VIN) U12.3(EN)
SPI2MOSI: U10.8(_DIG:SDATA) ; also sheet 1,2
SPI2NSS_MAX: U10.10(_DIG:!CS) ; also sheet 1
SPI2SCK: U10.9(_DIG:SCLK) ; also sheet 1,2
VCC: C11.P$2 C37.P$1 C39.P$1 C40.P$1 C42.P$1 L2.P$2 R11.P$2 U10.11(_PWR:VCCVCO) U10.13(_PWR:VCCCP) U10.23(_PWR:VCCIF) U12.5(VOUT)
VCCIO: C44.P$1 C96.P$1 C107.P$1 R12.P$2 R19.P$2 U4.4(VDD) U10.14(_PWR:VCCD) U10.19(_PWR:VCCADC) ; also sheet 1,2,3,5,6,7
VDD: C6.P$2 R65.P$1 ; also sheet 5
Unconnected: U10.22(_PWR:NC1) U10.28(_PWR:NC2) U12.4(NC)

### Notes on the sheet
- RF LDO Regulator
- RF Frontend - Analog Section
- 3V3_RF
- RF Frontend Power Bypassing
- RF Frontend - Power
- RF Frontend - Digital Section
- RF Frontend / RF Power
- 2.3.1

## Sheet 5 of 7
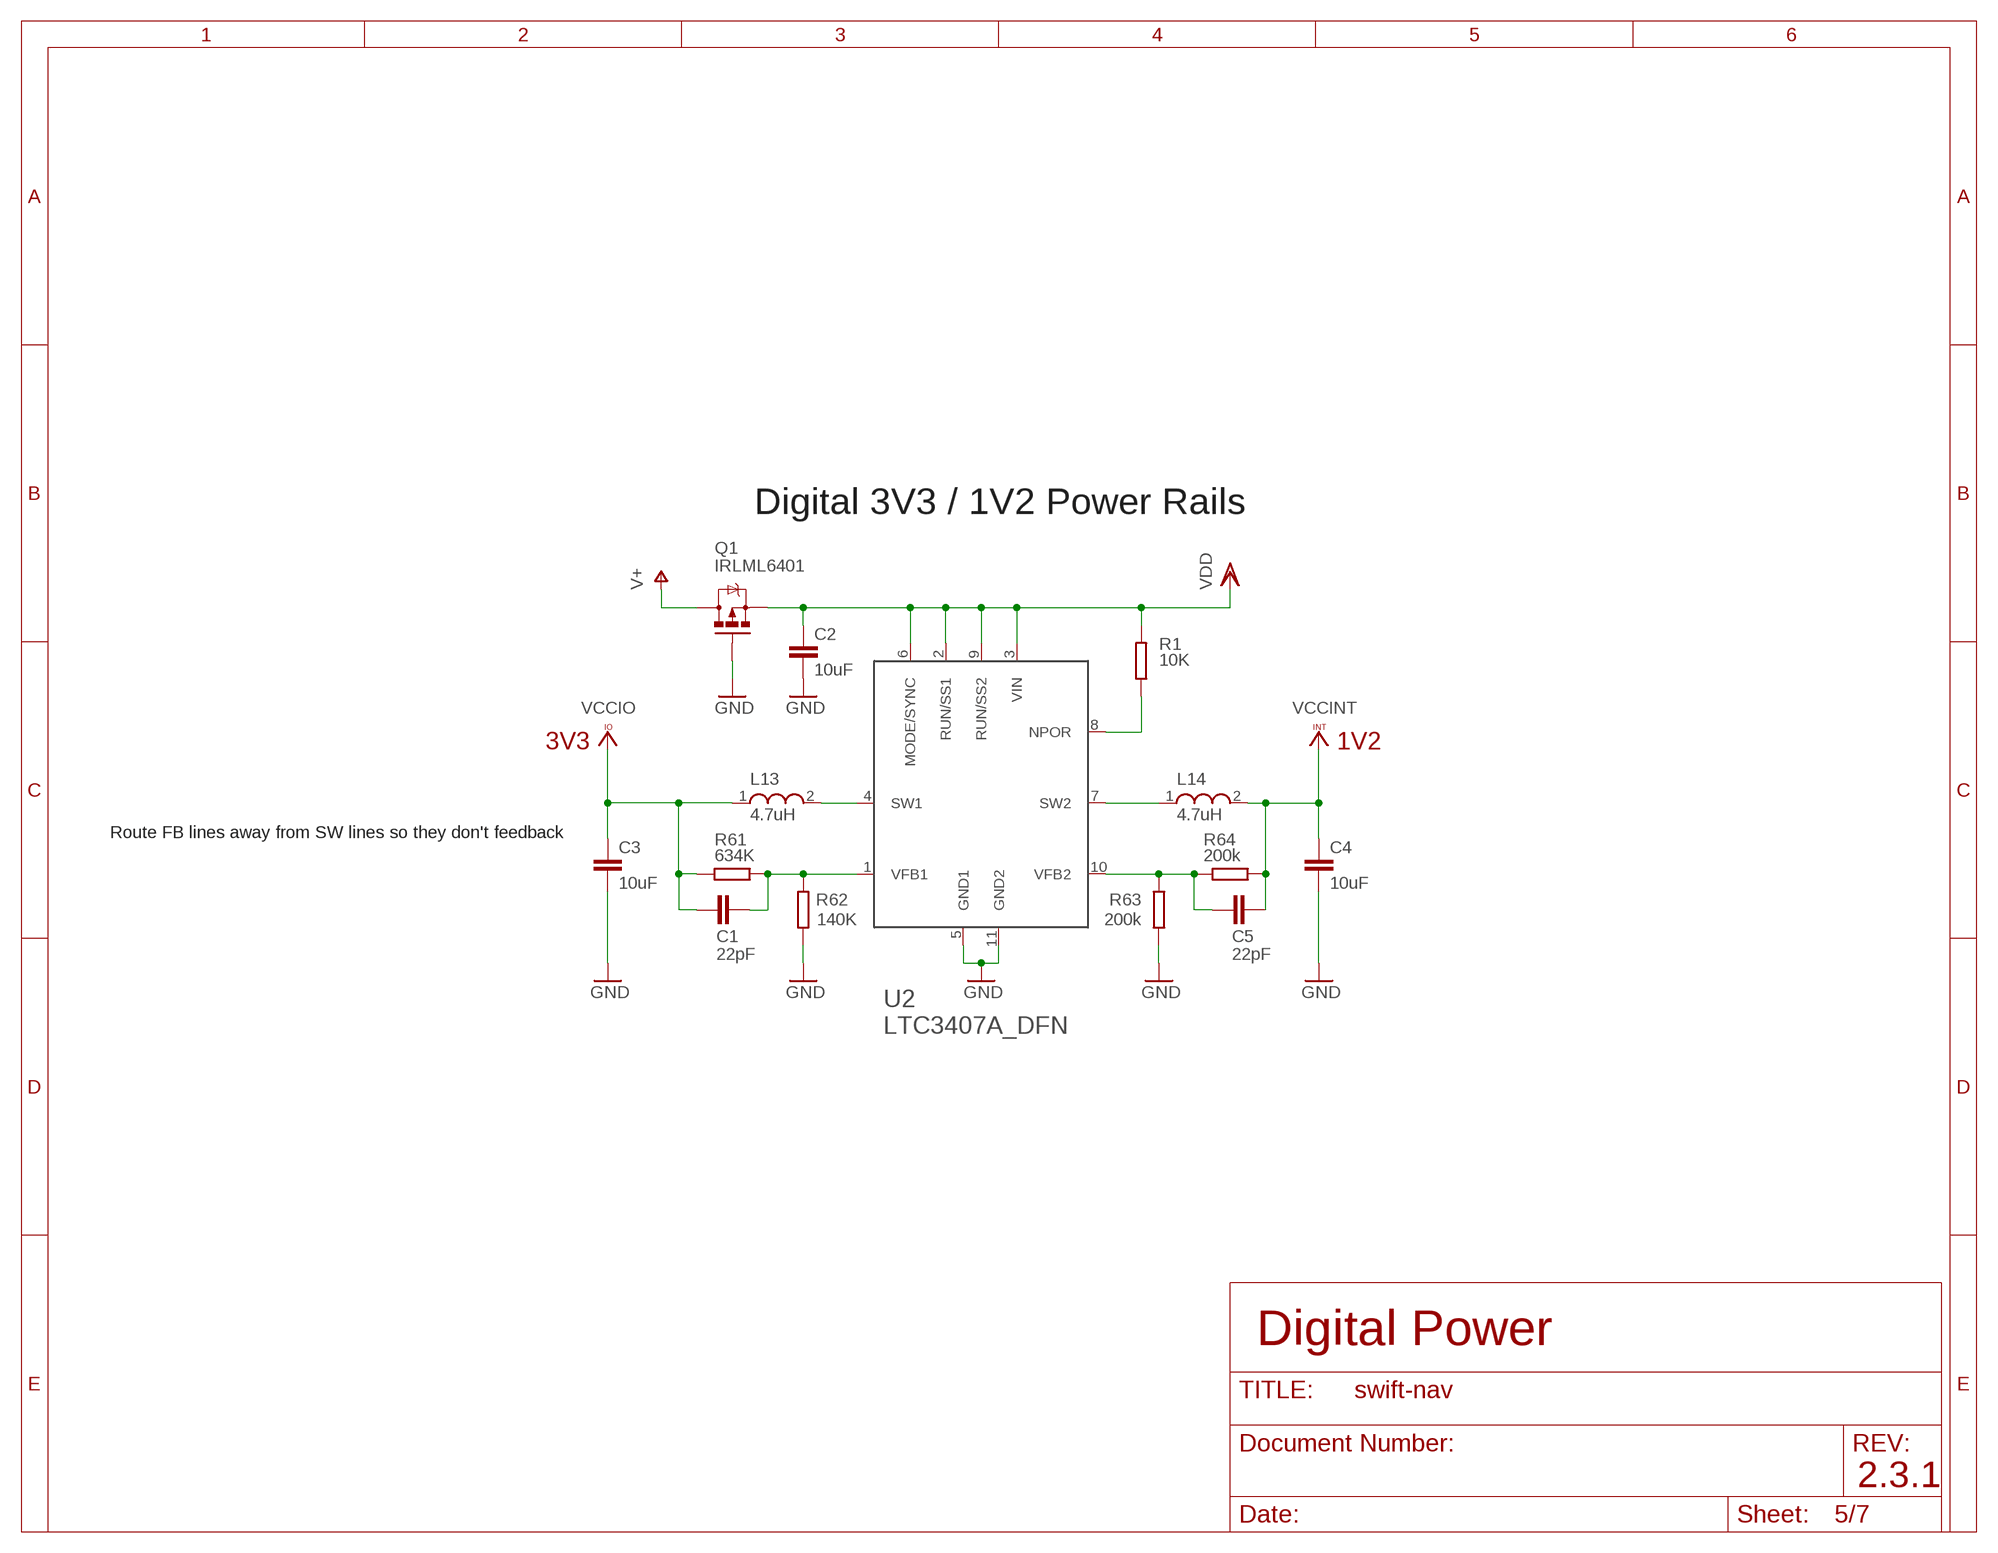
[diagram p4: schematic, sheet 5]

### Parts
C1  22pF  CAPACITOR-0402  [0402-CAP]
C2  10uF  CAPACITOR-1206  [1206-CAP]
C3  10uF  CAPACITOR-1206  [1206-CAP]
C4  10uF  CAPACITOR-1206  [1206-CAP]
C5  22pF  CAPACITOR-0402  [0402-CAP]
L13  4.7uH  LQM2HPN4R7MG0L  [LQM2HPN4R7MG0L]
L14  4.7uH  LQM2HPN4R7MG0L  [LQM2HPN4R7MG0L]
Q1  IRLML6401  MOSFET-PCHANNELSMD  [SOT23-3]
R1  10K  RESISTOR-0402  [0402-RES]
R61  634K  RESISTOR-0402  [0402-RES]
R62  140K  RESISTOR-0402  [0402-RES]
R63  200k  RESISTOR-0402  [0402-RES]
R64  200k  RESISTOR-0402  [0402-RES]
U2  LTC3407A_DFN  [DFN10]

### Nets
GND: C2.P$2 C3.P$2 C4.P$2 Q1.1(G) R62.P$2 R63.P$2 U2.5(GND1) U2.11(GND2) ; also sheet 1,2,3,4,6,7
N$16: R1.P$1 U2.8(NPOR)
N$17: L13.2 U2.4(SW1)
N$26: L14.1 U2.7(SW2)
N$53: C1.P$1 R61.P$1 R62.P$1 U2.1(VFB1)
N$54: C5.P$2 R63.P$1 R64.P$1 U2.10(VFB2)
V+: Q1.3(D) ; also sheet 7
VCCINT: C4.P$1 C5.P$1 L14.2 R64.P$2 ; also sheet 3
VCCIO: C1.P$2 C3.P$1 L13.1 R61.P$2 ; also sheet 1,2,3,4,6,7
VDD: C2.P$1 Q1.2(S) R1.P$2 U2.2(RUN/SS1) U2.3(VIN) U2.6(MODE/SYNC) U2.9(RUN/SS2) ; also sheet 4

### Notes on the sheet
- Digital 3V3 / 1V2 Power Rails
- 3V3 | 1V2
- Route FB lines away from SW lines so they don't feedback
- Digital Power
- 2.3.1

## Sheet 6 of 7
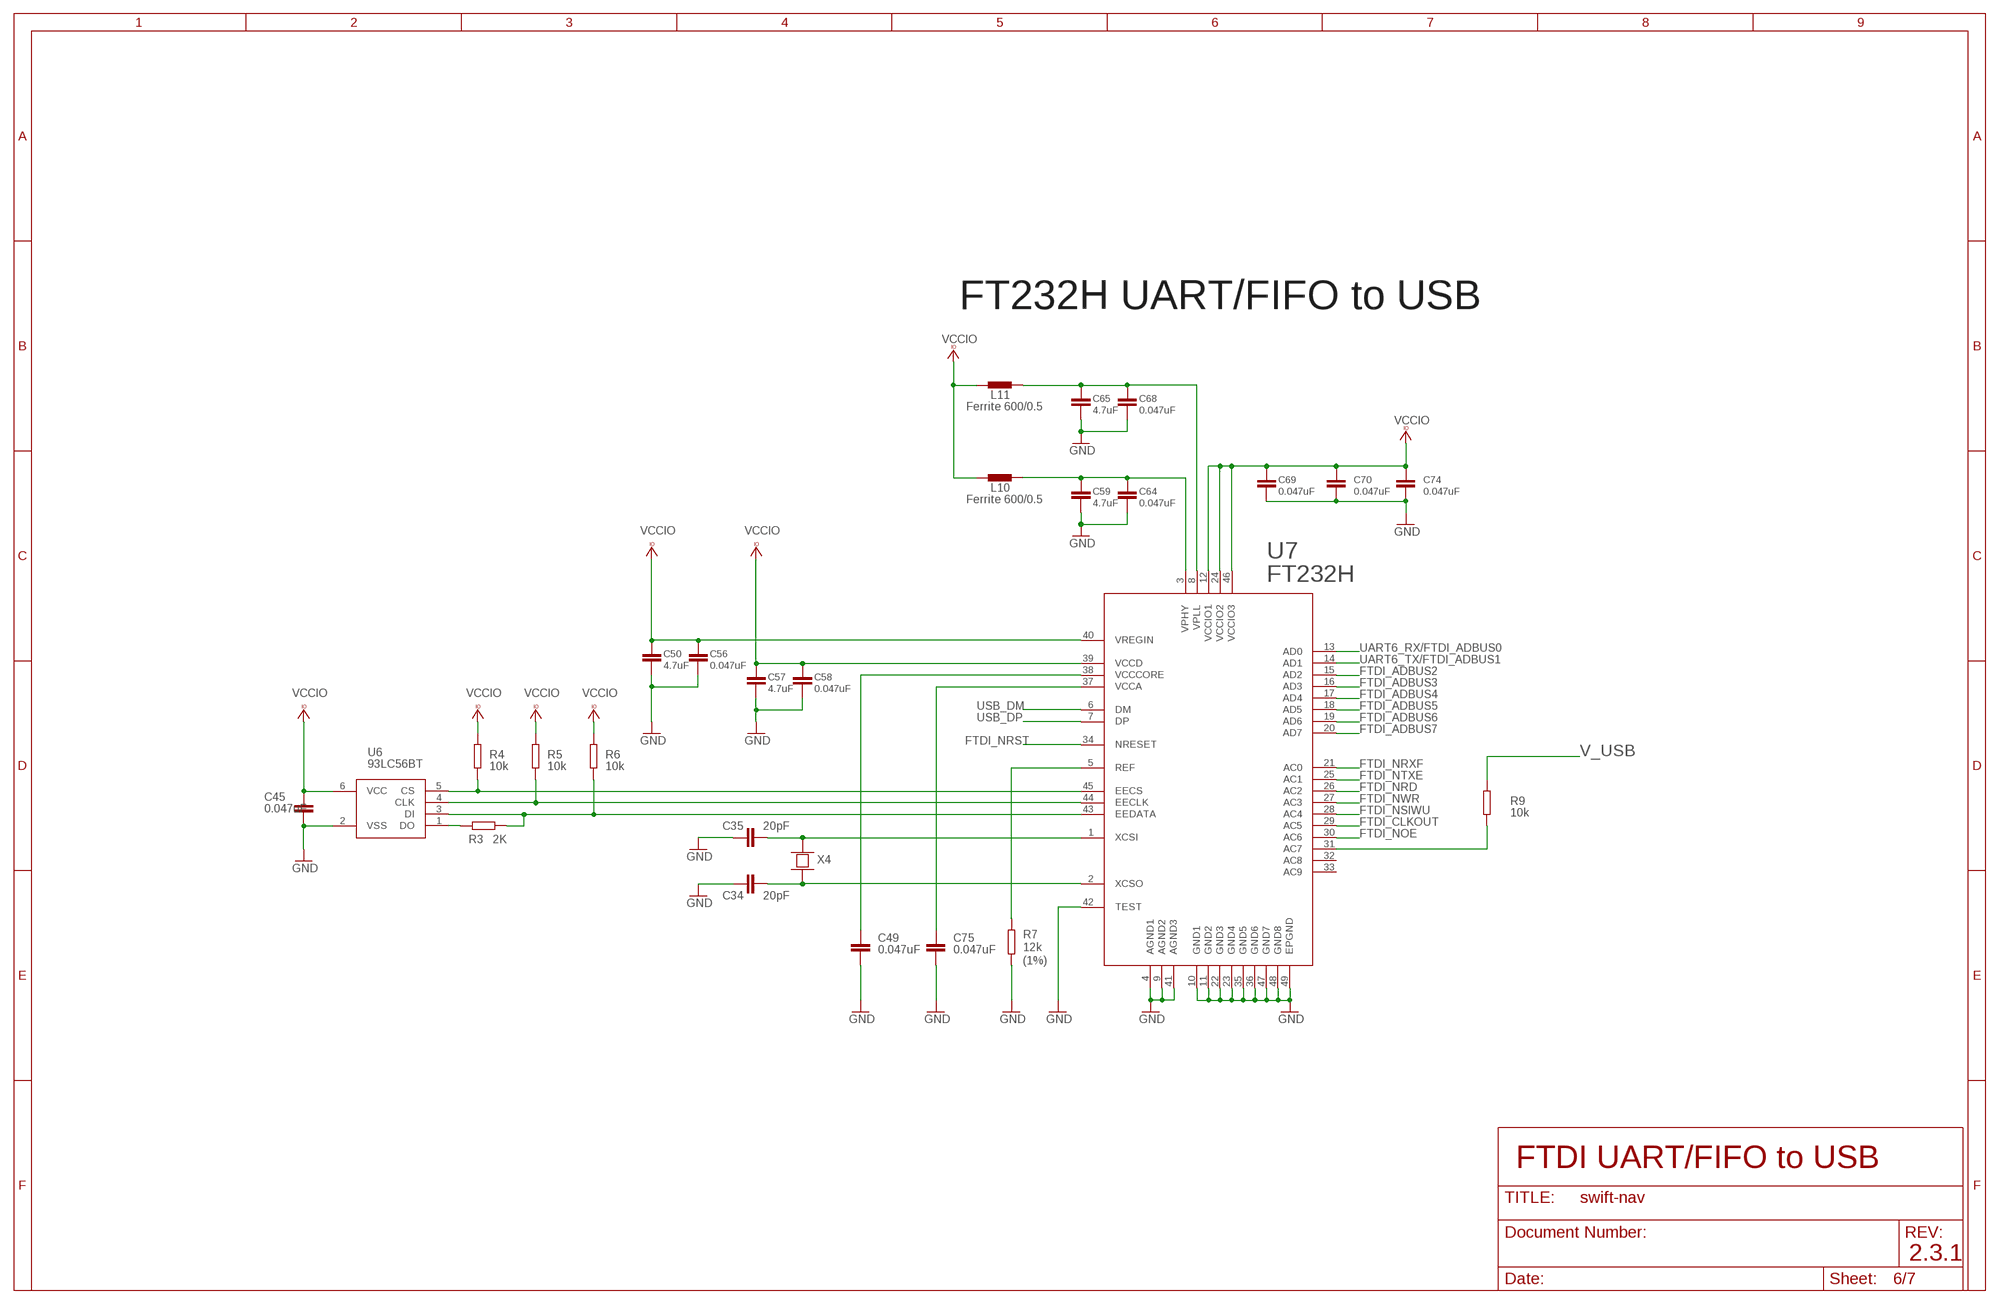
[diagram p5: schematic, sheet 6]

### Parts
C34  20pF  CAPACITOR-0402  [0402-CAP]
C35  20pF  CAPACITOR-0402  [0402-CAP]
C45  0.047uF  C-EUC0402  [C0402]
C49  0.047uF  CAPACITOR-0402  [0402-CAP]
C50  4.7uF  CAPACITOR-0603  [0603-CAP]
C56  0.047uF  CAPACITOR-0402  [0402-CAP]
C57  4.7uF  CAPACITOR-0603  [0603-CAP]
C58  0.047uF  CAPACITOR-0402  [0402-CAP]
C59  4.7uF  CAPACITOR-0603  [0603-CAP]
C64  0.047uF  CAPACITOR-0402  [0402-CAP]
C65  4.7uF  CAPACITOR-0603  [0603-CAP]
C68  0.047uF  CAPACITOR-0402  [0402-CAP]
C69  0.047uF  C-EUC0603  [C0603]
C70  0.047uF  CAPACITOR-0402  [0402-CAP]
C74  0.047uF  CAPACITOR-0402  [0402-CAP]
C75  0.047uF  CAPACITOR-0402  [0402-CAP]
L10  Ferrite 600/0.5  INDUCTOR-0805  [0805-IND]
L11  Ferrite 600/0.5  INDUCTOR-0805  [0805-IND]
R3  2K  RESISTOR-0402  [0402-RES]
R4  10k  RESISTOR-0402  [0402-RES]
R5  10k  RESISTOR-0402  [0402-RES]
R6  10k  RESISTOR-0402  [0402-RES]
R7  12k  RESISTOR-0402  [0402-RES]
R9  10k  RESISTOR-0402  [0402-RES]
U6  93LC56BT-I/OT  [93AA56BT-I/OT]
U7  FT232HQ  [FT232HQ]
X4  NX5032GA-12M  [NX5032GA]

### Nets
FTDI_ADBUS2: U7.15(AD2) ; also sheet 2
FTDI_ADBUS3: U7.16(AD3) ; also sheet 2
FTDI_ADBUS4: U7.17(AD4) ; also sheet 2
FTDI_ADBUS5: U7.18(AD5) ; also sheet 2
FTDI_ADBUS6: U7.19(AD6) ; also sheet 2
FTDI_ADBUS7: U7.20(AD7) ; also sheet 2
FTDI_CLKOUT: U7.29(AC5) ; also sheet 2
FTDI_NOE: U7.30(AC6) ; also sheet 2
FTDI_NRD: U7.26(AC2) ; also sheet 2
FTDI_NRST: U7.34(NRESET) ; also sheet 1
FTDI_NRXF: U7.21(AC0) ; also sheet 2
FTDI_NSIWU: U7.28(AC4) ; also sheet 2
FTDI_NTXE: U7.25(AC1) ; also sheet 2
FTDI_NWR: U7.27(AC3) ; also sheet 2
GND: C34.P$2 C35.P$2 C45.2 C49.P$2 C50.P$1 C56.P$2 C57.P$1 C58.P$2 C59.P$1 C64.P$2 C65.P$1 C68.P$2 C69.2 C70.P$2 C74.P$2 C75.P$2 R7.P$2 U6.2(VSS) U7.4(AGND1) U7.9(AGND2) U7.10(GND1) U7.11(GND2) U7.22(GND3) U7.23(GND4) U7.35(GND5) U7.36(GND6) U7.41(AGND3) U7.42(TEST) U7.47(GND7) U7.48(GND8) U7.49(EPGND) ; also sheet 1,2,3,4,5,7
N$9: C34.P$1 U7.2(XCSO) X4.2
N$15: C35.P$1 U7.1(XCSI) X4.1
N$19: C49.P$1 U7.38(VCCCORE)
N$20: R9.P$2 U7.31(AC7)
N$21: C65.P$2 C68.P$1 L11.P$2 U7.8(VPLL)
N$23: R4.P$2 U6.5(CS) U7.45(EECS)
N$25: R5.P$2 U6.4(CLK) U7.44(EECLK)
N$27: R3.P$1 R6.P$2 U6.3(DI) U7.43(EEDATA)
N$28: R3.P$2 U6.1(DO)
N$29: C59.P$2 C64.P$1 L10.P$2 U7.3(VPHY)
N$32: C75.P$1 U7.37(VCCA)
N$33: R7.P$1 U7.5(REF)
UART6_RX/FTDI_ADBUS0: U7.13(AD0) ; also sheet 1,2
UART6_TX/FTDI_ADBUS1: U7.14(AD1) ; also sheet 1,2
USB_DM: U7.6(DM) ; also sheet 7
USB_DP: U7.7(DP) ; also sheet 7
V_USB: R9.P$1 ; also sheet 1,7
VCCIO: C45.1 C50.P$2 C56.P$1 C57.P$2 C58.P$1 C69.1 C70.P$1 C74.P$1 L10.P$1 L11.P$1 R4.P$1 R5.P$1 R6.P$1 U6.6(VCC) U7.12(VCCIO1) U7.24(VCCIO2) U7.39(VCCD) U7.40(VREGIN) U7.46(VCCIO3) ; also sheet 1,2,3,4,5,7
Unconnected: U7.32(AC8) U7.33(AC9)

### Notes on the sheet
- FT232H UART/FIFO to USB
- (1%)
- FTDI UART/FIFO to USB
- 2.3.1

## Sheet 7 of 7
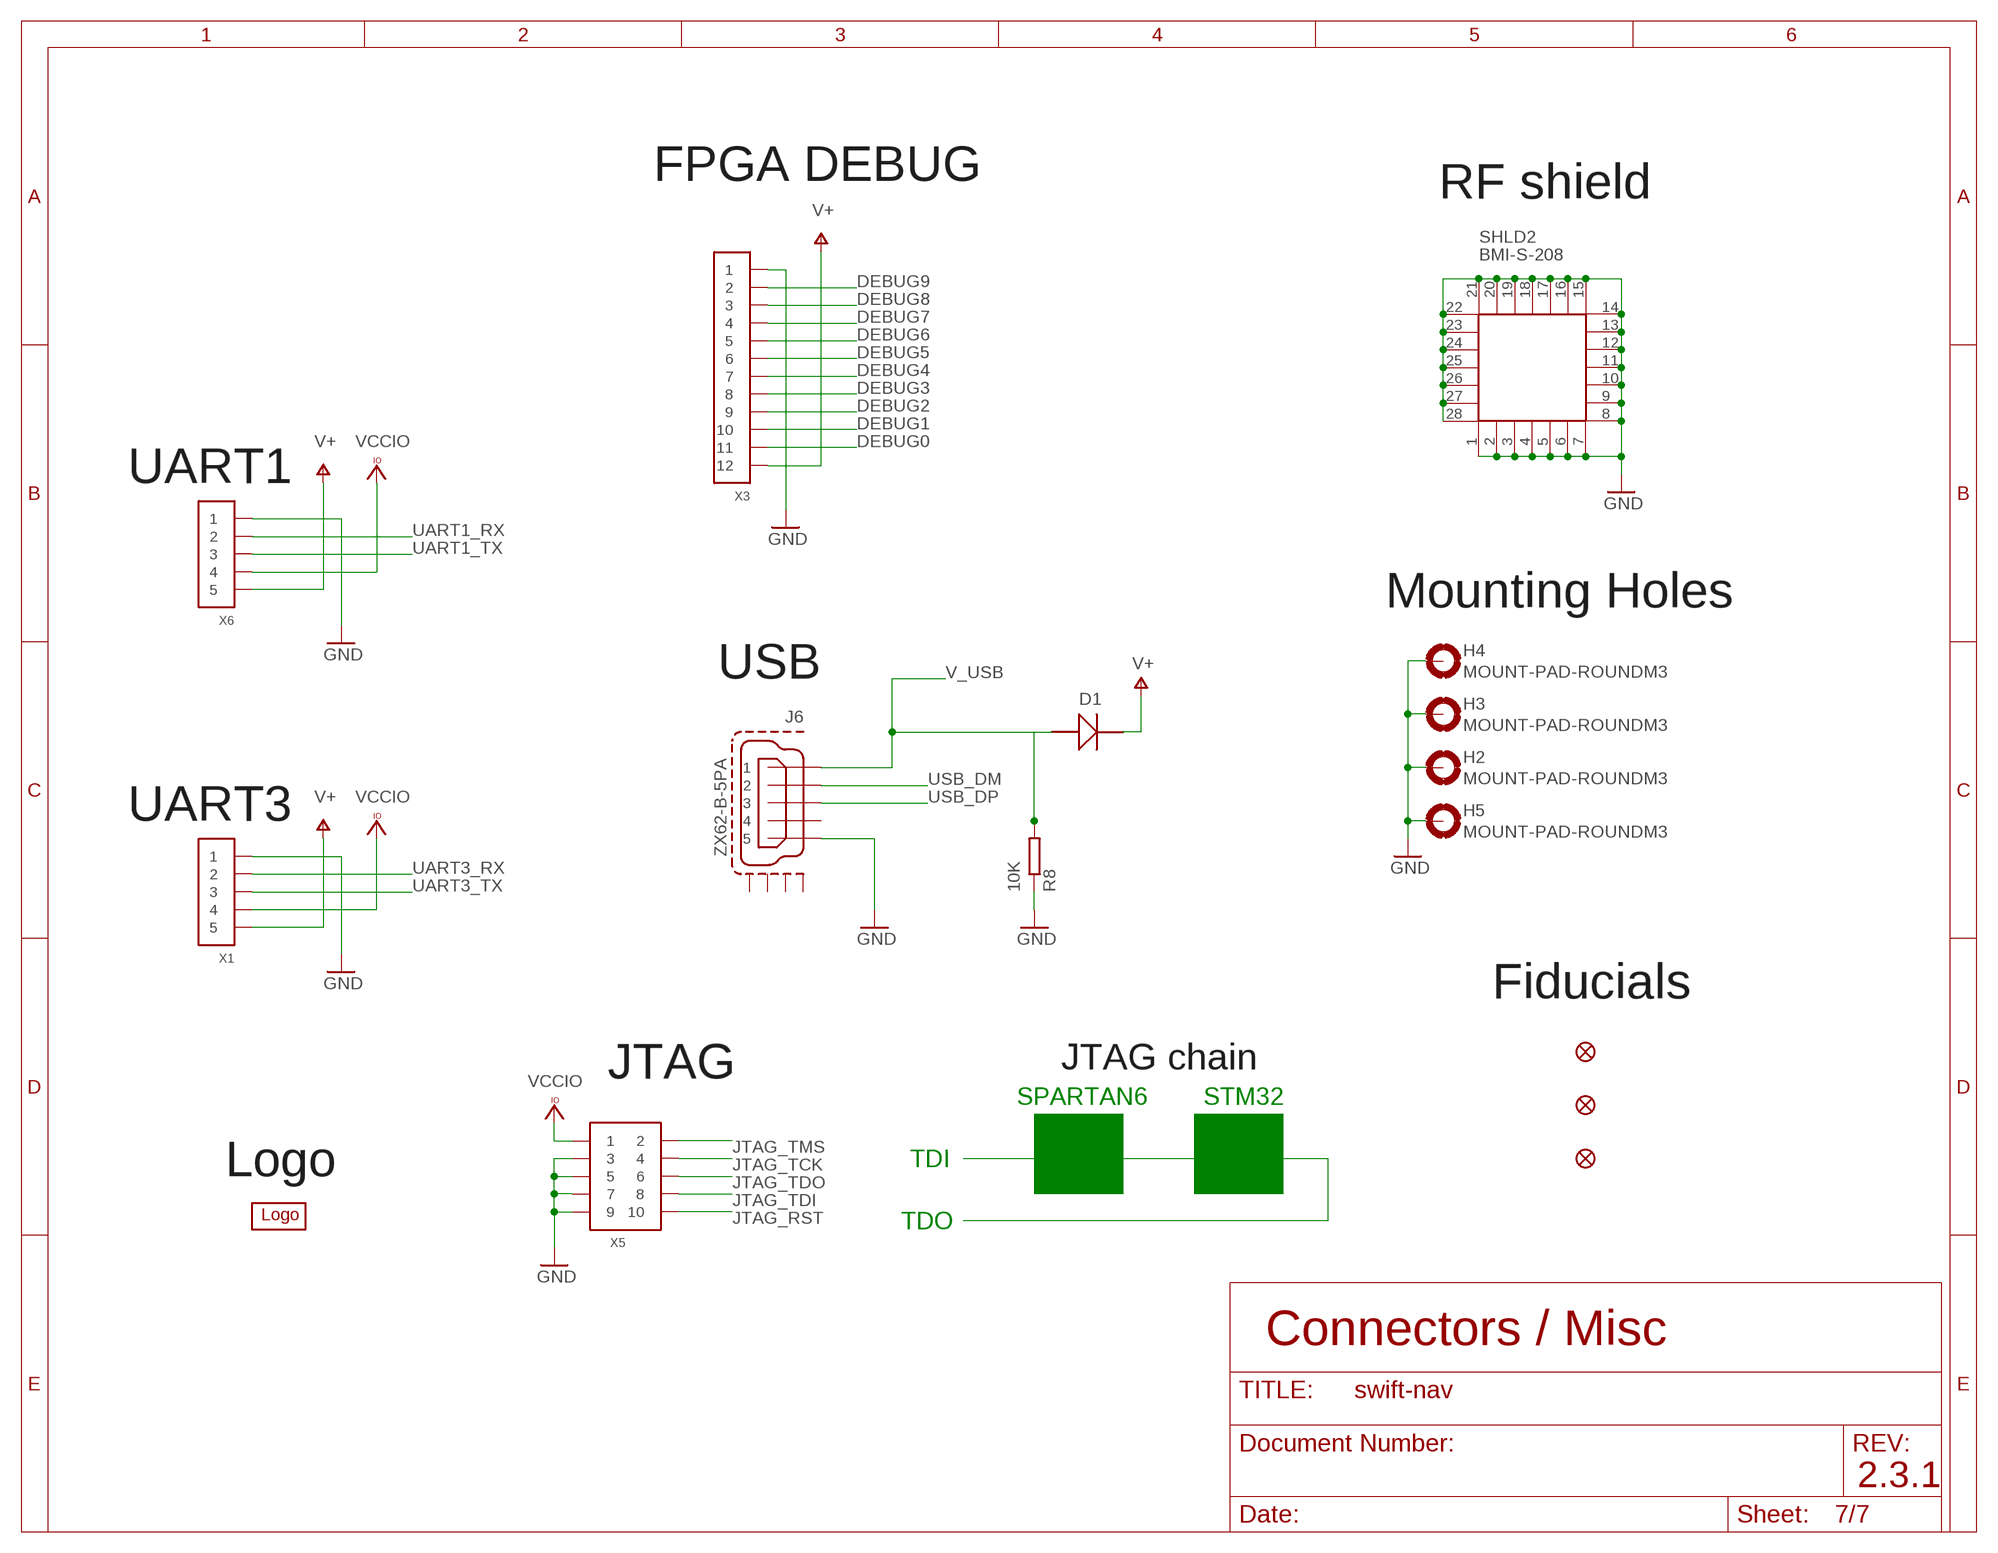
[diagram p6: schematic, sheet 7]

### Parts
D1  MBR0520  [SOD-123]
H2  MOUNT-PAD-ROUNDM3  [M3-PAD]
H3  MOUNT-PAD-ROUNDM3  [M3-PAD]
H4  MOUNT-PAD-ROUNDM3  [M3-PAD]
H5  MOUNT-PAD-ROUNDM3  [M3-PAD]
J6  ZX62-B-5PA  [ZX62-B-5PA]
JP8  FIDUCIAL1.5X3  [FIDUCIAL-1.5X3]
JP9  FIDUCIAL1.5X3  [FIDUCIAL-1.5X3]
JP10  FIDUCIAL1.5X3  [FIDUCIAL-1.5X3]
R8  10K  RESISTOR-0402  [0402-RES]
SHLD2  BMI-S-208  [BMI-S-208]
U$2  LOGOLOGO3_SMALL  [LOGO3_SMALL]
X1  CONN_5-1-53261  [PB-53261-05]
X3  FPGA DEBUG  CONN_12-1-53261  [PB-53261-12]
X5  CONN_5-2  [FTSH-105-D]
X6  CONN_5-1-53261  [PB-53261-05]

### Nets
DEBUG0: X3.11 ; also sheet 2
DEBUG1: X3.10 ; also sheet 2
DEBUG2: X3.9 ; also sheet 2
DEBUG3: X3.8 ; also sheet 2
DEBUG4: X3.7 ; also sheet 2
DEBUG5: X3.6 ; also sheet 2
DEBUG6: X3.5 ; also sheet 2
DEBUG7: X3.4 ; also sheet 2
DEBUG8: X3.3 ; also sheet 2
DEBUG9: X3.2 ; also sheet 2
GND: H2.B3,0(MOUNT) H3.B3,0(MOUNT) H4.B3,0(MOUNT) H5.B3,0(MOUNT) J6.PIN_5 R8.P$1 SHLD2.1 SHLD2.2 SHLD2.3 SHLD2.4 SHLD2.5 SHLD2.6 SHLD2.7 SHLD2.8 SHLD2.9 SHLD2.10 SHLD2.11 SHLD2.12 SHLD2.13 SHLD2.14 SHLD2.15 SHLD2.16 SHLD2.17 SHLD2.18 SHLD2.19 SHLD2.20 SHLD2.21 SHLD2.22 SHLD2.23 SHLD2.24 SHLD2.25 SHLD2.26 SHLD2.27 SHLD2.28 X1.1 X3.1 X5.3 X5.5 X5.7 X5.9 X6.1 ; also sheet 1,2,3,4,5,6
JTAG_RST: X5.10 ; also sheet 1
JTAG_TCK: X5.4 ; also sheet 1,2
JTAG_TDI: X5.8 ; also sheet 2
JTAG_TDO: X5.6 ; also sheet 1
JTAG_TMS: X5.2 ; also sheet 1,2
UART1_RX: X6.2 ; also sheet 1
UART1_TX: X6.3 ; also sheet 1
UART3_RX: X1.2 ; also sheet 1
UART3_TX: X1.3 ; also sheet 1
USB_DM: J6.PIN_2 ; also sheet 6
USB_DP: J6.PIN_3 ; also sheet 6
V+: D1.2 X1.5 X3.12 X6.5 ; also sheet 5
V_USB: D1.1 J6.PIN_1 R8.P$2 ; also sheet 1,6
VCCIO: X1.4 X5.1 X6.4 ; also sheet 1,2,3,4,5,6
Unconnected: J6.GND_LEFT(S1) J6.GND_RIGHT(S2) J6.GND_UP_LEFT(S3) J6.GND_UP_RIGHT(S4) J6.PIN_4

### Notes on the sheet
- RF shield
- UART1
- Mounting Holes
- USB
- UART3
- Fiducials
- JTAG | JTAG chain
- SPARTAN6 | STM32
- Logo
- TDI
- TDO
- Connectors / Misc
- 2.3.1

## Library data of the parts
B1 = jobygnss:B3U-1000P
C1-C20 C22 C23 C27-C44 C46-C68 C70-C78 C80-C82 C95 C96 C107 = pel_dipol_comp:CAPACITOR
C21 C24-C26 C86 C87 = swift-nav:C1210
C45 C69 = rcl:C-EU: CAPACITOR, European symbol
D1 = swift-nav:MBR0520
H2-H5 = swift-nav:MOUNT-PAD-ROUND: MOUNTING PAD, round
J1 = swift-nav:SMA_EDGE
J6 = open-bldc:ZX62-B-5PA
JP8-JP10 = aspirin:FIDUCIAL: Fiducial Alignment Points Various fiducial points for machine vision alignment.
L1-L5 L10 L11 = pel_dipol_comp:INDUCTOR
L13 L14 = jobygnss:LQM2HPN4R7MG0L
LED1 LED2 = pel_dipol_comp:LED
Q1 = SparkFun-DiscreteSemi:MOSFET-PCHANNEL: Generic PMOSFET
R1-R20 R28 R30 R34 R61-R65 = pel_dipol_comp:RESISTOR
SHLD2 = jobygnss:BMI-S-208
U1 = xilinx_devices:6SLX9FTG256: Xilinx FPGA: 6SLX9FTG256
U2 = jobygnss:LTC3407A_DFN
U3 = pel_stm32:STM32-M-64-LQFP: STM32F103 Medium Density 64pin LQFP
U4 = swift-nav:7Q-16.368MBG-T
U5 = joby_robotics:SMA_PATCH_SMDGND
U6 = swift-nav:93LC56BT-I/OT
U7 = swift-nav:FT232HQ
U8 = swift-nav:SAW_1.4X1.1
U9 = swift-nav:XC2401
U10 = jobygnss:MAX2769
U12 = jobygnss:PT7M8206B33TA5EX
U13 = jobygnss:M25P80_MLP8
U$2 = swift-nav:LOGO
X1 X6 = pel_molex:CONN_5-1
X3 = pel_molex:CONN_12-1
X4 = swift-nav:NX5032GA-12M
X5 = pel_misc:CONN_5-2